# EAGLE schematic AnodV2.1 (EAGLE 5.11)

## Sheet 1 of 2
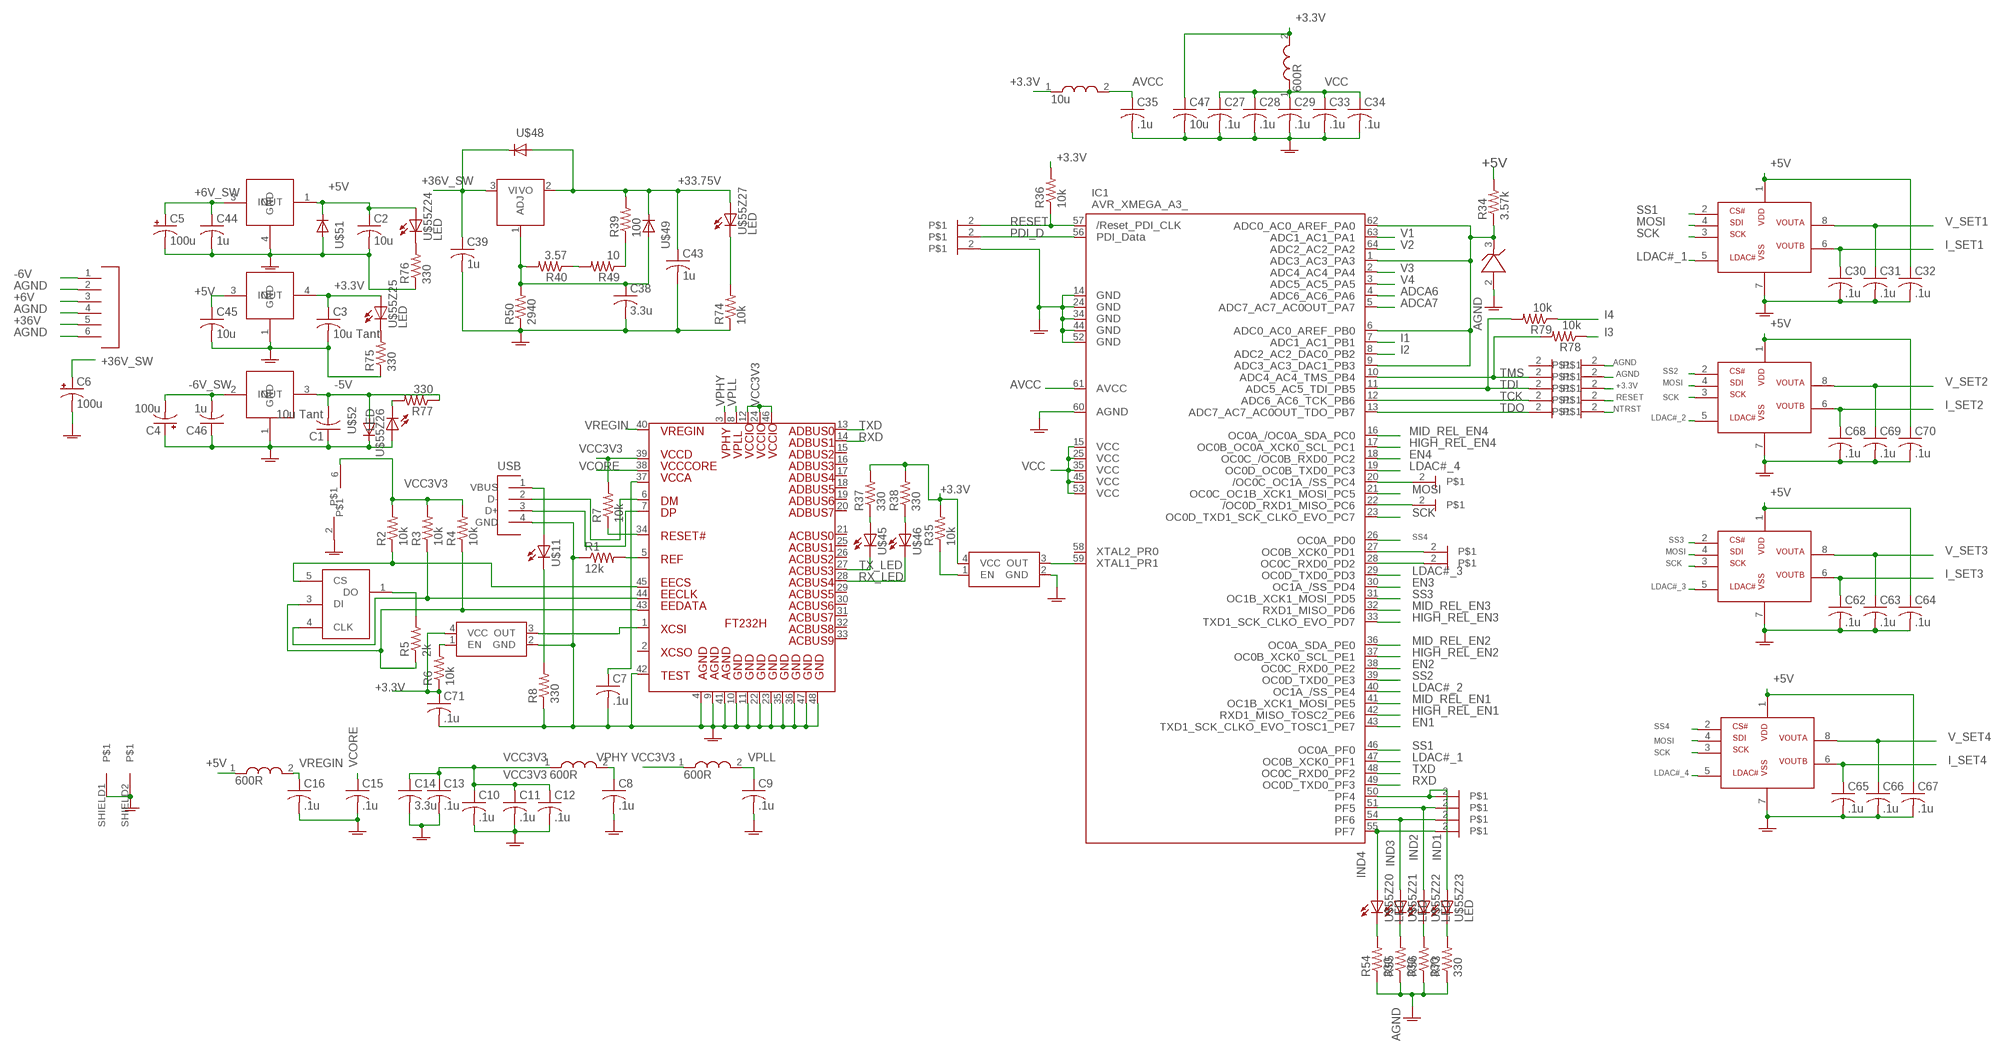
[diagram p0: schematic, sheet 1]

### Parts
C1  10u Tant  C-USC0805  [C0805]
C2  10u  C-USC0805  [C0805]
C3  10u Tant  C-USC0805  [C0805]
C4  100u  CPOL-USE3.5-8  [E3,5-8]
C5  100u  CPOL-USE3.5-8  [E3,5-8]
C6  100u  CPOL-USE3.5-8  [E3,5-8]
C7  .1u  C-USC0603  [C0603]
C8  .1u  C-USC0603  [C0603]
C9  .1u  C-USC0603  [C0603]
C10  .1u  C-USC0603  [C0603]
C11  .1u  C-USC0603  [C0603]
C12  .1u  C-USC0603  [C0603]
C13  .1u  C-USC0603  [C0603]
C14  3.3u  C-USC0603  [C0603]
C15  .1u  C-USC0603  [C0603]
C16  .1u  C-USC0603  [C0603]
C27  .1u  C-USC0603  [C0603]
C28  .1u  C-USC0603  [C0603]
C29  .1u  C-USC0603  [C0603]
C30  .1u  C-USC0603  [C0603]
C31  .1u  C-USC0603  [C0603]
C32  .1u  C-USC0603  [C0603]
C33  .1u  C-USC0603  [C0603]
C34  .1u  C-USC0603  [C0603]
C35  .1u  C-USC0603  [C0603]
C38  3.3u  C-USC0603  [C0603]
C39  1u  C-USC0603  [C0603]
C43  1u  C-USC0603  [C0603]
C44  1u  C-USC0603  [C0603]
C45  10u  C-USC0603  [C0603]
C46  1u  C-USC0603  [C0603]
C47  10u  C-USC0805  [C0805]
C62  .1u  C-USC0603  [C0603]
C63  .1u  C-USC0603  [C0603]
C64  .1u  C-USC0603  [C0603]
C65  .1u  C-USC0603  [C0603]
C66  .1u  C-USC0603  [C0603]
C67  .1u  C-USC0603  [C0603]
C68  .1u  C-USC0603  [C0603]
C69  .1u  C-USC0603  [C0603]
C70  .1u  C-USC0603  [C0603]
C71  .1u  C-USC0603  [C0603]
IC1  AVR_XMEGA_A3_  [TQFP64]
R1  12k  R-US_R0603  [R0603]
R2  10k  R-US_R0603  [R0603]
R3  10k  R-US_R0603  [R0603]
R4  10k  R-US_R0603  [R0603]
R5  2k  R-US_R0603  [R0603]
R6  10k  R-US_R0603  [R0603]
R7  10k  R-US_R0603  [R0603]
R8  330  R-US_R0603  [R0603]
R34  3.57k  R-US_R0603  [R0603]
R35  10k  R-US_R0603  [R0603]
R36  10k  R-US_R0603  [R0603]
R37  330  R-US_R0603  [R0603]
R38  330  R-US_R0603  [R0603]
R39  100  R-US_R0603  [R0603]
R40  3.57  R-US_R0603  [R0603]
R49  10  R-US_R0603  [R0603]
R50  2940  R-US_R0603  [R0603]
R54  330  R-US_R0603  [R0603]
R55  330  R-US_R0603  [R0603]
R56  330  R-US_R0603  [R0603]
R73  330  R-US_R0603  [R0603]
R74  10k  R-US_R0603  [R0603]
R75  330  R-US_R0603  [R0603]
R76  330  R-US_R0603  [R0603]
R77  330  R-US_R0603  [R0603]
R78  10k  R-US_R0603  [R0603]
R79  10k  R-US_R0603  [R0603]
U$1  LM2990  [TO263]
U$2  LP38690TO  [TO252]
U$3  NCP1117_3.3_REG  [TO252]
U$5  FT232H  [LQFP-48]
U$6  OSCILLATOR  [OSC]
U$7  600R  INDUCTOR0603  [0603]
U$8  600R  INDUCTOR0603  [0603]
U$9  EEPROM  [SOT23-6]
U$10  USB_B  [USB_B]
U$11  LED  [CHIPLED_0805]
U$12  600R  INDUCTOR0603  [0603]
U$30  1.22V  ZXRE1004  [SOT23]
U$31  MCP4812_DAC  [MSOP8]
U$32  OSCILLATOR  [OSC]
U$40  10u  INDUCTOR0805  [0805]
U$45  LED  [CHIPLED_0805]
U$46  LED  [CHIPLED_0805]
U$47  LM317  [TO263]
U$48  ES1G-TP_DIODE'  [DO-214AC]
U$49  ES1G-TP_DIODE'  [DO-214AC]
U$50  DIN6_CONNECTOR  [DIN6]
U$51  ES1G-TP_DIODE'  [DO-214AC]
U$52  ES1G-TP_DIODE'  [DO-214AC]
U$53  600R  INDUCTOR0603  [0603]
U$55Z2  HEADER_PIN  [PIN_.100]
U$55Z3  HEADER_PIN  [PIN_.100]
U$55Z4  HEADER_PIN  [PIN_.100]
U$55Z5  HEADER_PIN  [PIN_.100]
U$55Z6  HEADER_PIN  [PIN_.100]
U$55Z7  HEADER_PIN  [PIN_.100]
U$55Z8  HEADER_PIN  [PIN_.100]
U$55Z9  HEADER_PIN  [PIN_.100]
U$55Z10  HEADER_PIN  [PIN_.100]
U$55Z11  HEADER_PIN  [PIN_.100]
U$55Z12  HEADER_PIN  [PIN_.100]
U$55Z13  HEADER_PIN  [PIN_.100]
U$55Z14  HEADER_PIN  [PIN_.100]
U$55Z15  HEADER_PIN  [PIN_.100]
U$55Z16  HEADER_PIN  [PIN_.100]
U$55Z17  HEADER_PIN  [PIN_.100]
U$55Z18  HEADER_PIN  [PIN_.100]
U$55Z19  HEADER_PIN  [PIN_.100]
U$55Z20  LED  [CHIPLED_0805]
U$55Z21  LED  [CHIPLED_0805]
U$55Z22  LED  [CHIPLED_0805]
U$55Z23  LED  [CHIPLED_0805]
U$55Z24  LED  [CHIPLED_0805]
U$55Z25  LED  [CHIPLED_0805]
U$55Z26  LED  [CHIPLED_0805]
U$55Z27  LED  [CHIPLED_0805]
U$55Z28  HEADER_PIN  [PIN_.100]
U$55Z29  HEADER_PIN  [PIN_.100]
U$55Z30  HEADER_PIN  [PIN_.100]
U$56  MCP4812_DAC  [MSOP8]
U$57  MCP4812_DAC  [MSOP8]
U$58  MCP4812_DAC  [MSOP8]

### Nets
+3.3V: C3.1 C47.1 C71.1 R6.1 R35.2 R36.2 R37.2 R38.2 U$3.4(OUT) U$6.4(VCC) U$32.4(VCC) U$40.1 U$53.2 U$55Z9.2 U$55Z25.A
+5V: C2.1 C32.1 C45.1 C64.1 C67.1 C70.1 R34.2 U$2.1(OUT) U$3.3(IN) U$12.1 U$31.1 U$51.C U$55Z24.A U$56.1 U$57.1 U$58.1 ; also sheet 2
+6V: U$50.3
+6V_SW: C5.+ C44.1 U$2.3(IN)
+33.75V: C43.1 R39.2 U$47.2(VO) U$48.A U$49.C U$55Z27.A ; also sheet 2
+36V: U$50.5
+36V_SW: C6.+ C39.1 U$47.3(VI) U$48.C
-5V: C1.2 R77.1 U$1.3(OUT) U$52.A ; also sheet 2
-6V: U$50.1
-6V_SW: C4.- C46.2 U$1.2(IN)
ADCA6: IC1.4(PA6)
ADCA7: IC1.5(PA7)
AGND: C1.1 C2.2 C3.2 C4.+ C5.- C6.- C7.2 C8.2 C9.2 C10.2 C11.2 C12.2 C13.2 C14.2 C15.2 C16.2 C27.2 C28.2 C29.2 C30.2 C31.2 C32.2 C33.2 C34.2 C35.2 C38.2 C39.2 C43.2 C44.2 C45.2 C46.1 C47.2 C62.2 C63.2 C64.2 C65.2 C66.2 C67.2 C68.2 C69.2 C70.2 C71.2 IC1.14(GND1) IC1.24(GND2) IC1.34(GND3) IC1.44(GND4) IC1.52(GND5) IC1.60(AGND) R1.1 R8.1 R50.1 R54.1 R55.1 R56.1 R73.1 R74.1 R75.1 R76.1 U$1.1(GND) U$2.4(GND) U$3.1(GND) U$5.4 U$5.9 U$5.10 U$5.11 U$5.22 U$5.23 U$5.35 U$5.36 U$5.41 U$5.42 U$5.47 U$5.48 U$6.2(GND) U$9.2 U$10.4(GND) U$10.SHIELD1 U$10.SHIELD2 U$30.2(GND) U$31.7 U$32.2(GND) U$50.2 U$50.4 U$50.6 U$51.A U$52.C U$55Z7.2 U$55Z8.2 U$55Z26.A U$55Z30.2 U$56.7 U$57.7 U$58.7 ; also sheet 2
AVCC: C35.1 IC1.61(AVCC) U$40.2
EN1: IC1.43(PE7) ; also sheet 2
EN2: IC1.38(PE2) ; also sheet 2
EN3: IC1.30(PD4) ; also sheet 2
EN4: IC1.18(PC2) ; also sheet 2
HIGH_REL_EN1: IC1.42(PE6) ; also sheet 2
HIGH_REL_EN2: IC1.37(PE1) ; also sheet 2
HIGH_REL_EN3: IC1.33(PD7) ; also sheet 2
HIGH_REL_EN4: IC1.17(PC1) ; also sheet 2
I1: IC1.7(PB1) ; also sheet 2
I2: IC1.8(PB2) ; also sheet 2
I3: R78.1 ; also sheet 2
I4: R79.1 ; also sheet 2
I_SET1: C30.1 U$31.6 ; also sheet 2
I_SET2: C68.1 U$58.6 ; also sheet 2
I_SET3: C62.1 U$56.6 ; also sheet 2
I_SET4: C65.1 U$57.6 ; also sheet 2
IND1: IC1.50(PF4) U$55Z12.2 U$55Z23.A
IND2: IC1.51(PF5) U$55Z13.2 U$55Z22.A
IND3: IC1.54(PF6) U$55Z14.2 U$55Z21.A
IND4: IC1.55(PF7) U$55Z15.2 U$55Z20.A
LDAC#_1: IC1.47(PF1) U$31.5
LDAC#_2: IC1.40(PE4) U$58.5
LDAC#_3: IC1.29(PD3) U$56.5
LDAC#_4: IC1.19(PC3) U$57.5
MID_REL_EN1: IC1.41(PE5) ; also sheet 2
MID_REL_EN2: IC1.36(PE0) ; also sheet 2
MID_REL_EN3: IC1.32(PD6) ; also sheet 2
MID_REL_EN4: IC1.16(PC0) ; also sheet 2
MOSI: IC1.21(PC5) U$31.4 U$56.4 U$57.4 U$58.4
N$2: R1.2 U$5.5
N$3: U$5.1 U$6.3(OUT)
N$5: C7.1 U$5.37
N$6: R2.1 U$5.45 U$9.5(CS)
N$7: R3.1 U$5.44 U$9.4(CLK)
N$8: R4.1 R5.1 U$5.43 U$9.3(DI)
N$9: IC1.22(PC6) U$55Z18.2
N$10: R6.2 U$6.1(EN)
N$11: R5.2 U$9.1(DO)
N$12: R7.1 U$5.34
N$13: U$5.6 U$10.2(D-)
N$14: IC1.28(PD2) U$55Z17.2
N$15: U$5.7 U$10.3(D+)
N$16: U$10.1(VBUS) U$11.A
N$17: R8.2 U$11.C
N$54: IC1.59(PR1) U$32.3(OUT)
N$59: R37.1 U$45.A
N$61: R38.1 U$46.A
N$63: IC1.1(PA3) IC1.6(PB0) IC1.9(PB3) IC1.62(PA0) R34.1 U$30.3(VR)
N$64: C38.1 R40.2 R50.2 U$47.1(ADJ) U$49.A
N$65: R39.1 R49.1
N$66: R35.1 U$32.1(EN)
N$67: R40.1 R49.2
N$68: IC1.20(PC4) U$55Z19.2
N$75: IC1.27(PD1) U$55Z16.2
N$77: R54.2 U$55Z20.C
N$78: R55.2 U$55Z21.C
N$79: R56.2 U$55Z22.C
N$81: R73.2 U$55Z23.C
N$82: R74.2 U$55Z27.C
N$83: R75.2 U$55Z25.C
N$84: R76.2 U$55Z24.C
N$99: R77.2 U$55Z26.C
NTRST: U$55Z11.2
PDI_D: IC1.56(PDI_DATA) U$55Z29.2
RESET: IC1.57(RESET) R36.1 U$55Z10.2 U$55Z28.2
RX_LED: U$5.28 U$46.C
RXD: IC1.49(PF3) U$5.14
SCK: IC1.23(PC7) U$31.3 U$56.3 U$57.3 U$58.3
SS1: IC1.46(PF0) U$31.2
SS2: IC1.39(PE3) U$58.2
SS3: IC1.31(PD5) U$56.2
SS4: IC1.26(PD0) U$57.2
TCK: IC1.12(PB6) U$55Z3.2
TDI: IC1.11(PB5) R79.2 U$55Z4.2
TDO: IC1.13(PB7) U$55Z2.2
TMS: IC1.10(PB4) R78.2 U$55Z5.2
TX_LED: U$5.27 U$45.C
TXD: IC1.48(PF2) U$5.13
V1: IC1.63(PA1) ; also sheet 2
V2: IC1.64(PA2) ; also sheet 2
V3: IC1.2(PA4) ; also sheet 2
V4: IC1.3(PA5) ; also sheet 2
V_SET1: C31.1 U$31.8 ; also sheet 2
V_SET2: C69.1 U$58.8 ; also sheet 2
V_SET3: C63.1 U$56.8 ; also sheet 2
V_SET4: C66.1 U$57.8 ; also sheet 2
VCC: C27.1 C28.1 C29.1 C33.1 C34.1 IC1.15(VCC1) IC1.25(VCC2) IC1.35(VCC3) IC1.45(VCC4) IC1.53(VCC5) U$53.1
VCC3V3: C10.1 C11.1 C12.1 C13.1 C14.1 R2.2 R3.2 R4.2 R7.2 U$5.12 U$5.24 U$5.39 U$5.46 U$7.1 U$8.1 U$9.6
VCORE: C15.1 U$5.38
VPHY: C8.1 U$5.3 U$7.2
VPLL: C9.1 U$5.8 U$8.2
VREGIN: C16.1 U$5.40 U$12.2
Unconnected: IC1.58(PR0) U$5.2 U$5.15 U$5.16 U$5.17 U$5.18 U$5.19 U$5.20 U$5.21 U$5.25 U$5.26 U$5.29 U$5.30 U$5.31 U$5.32 U$5.33 U$55Z6.2

### Notes on the sheet
- USB

## Sheet 2 of 2
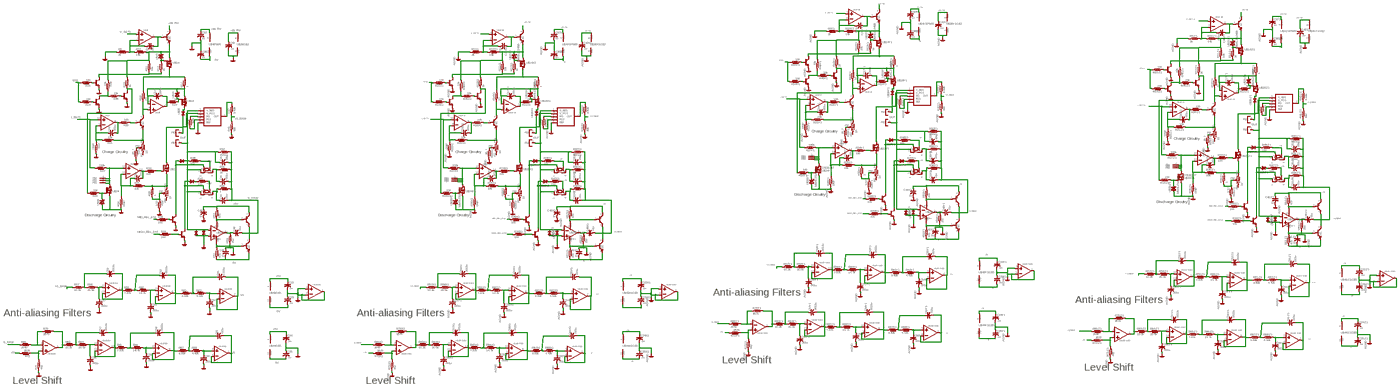
[diagram p1: schematic, sheet 2, overview]
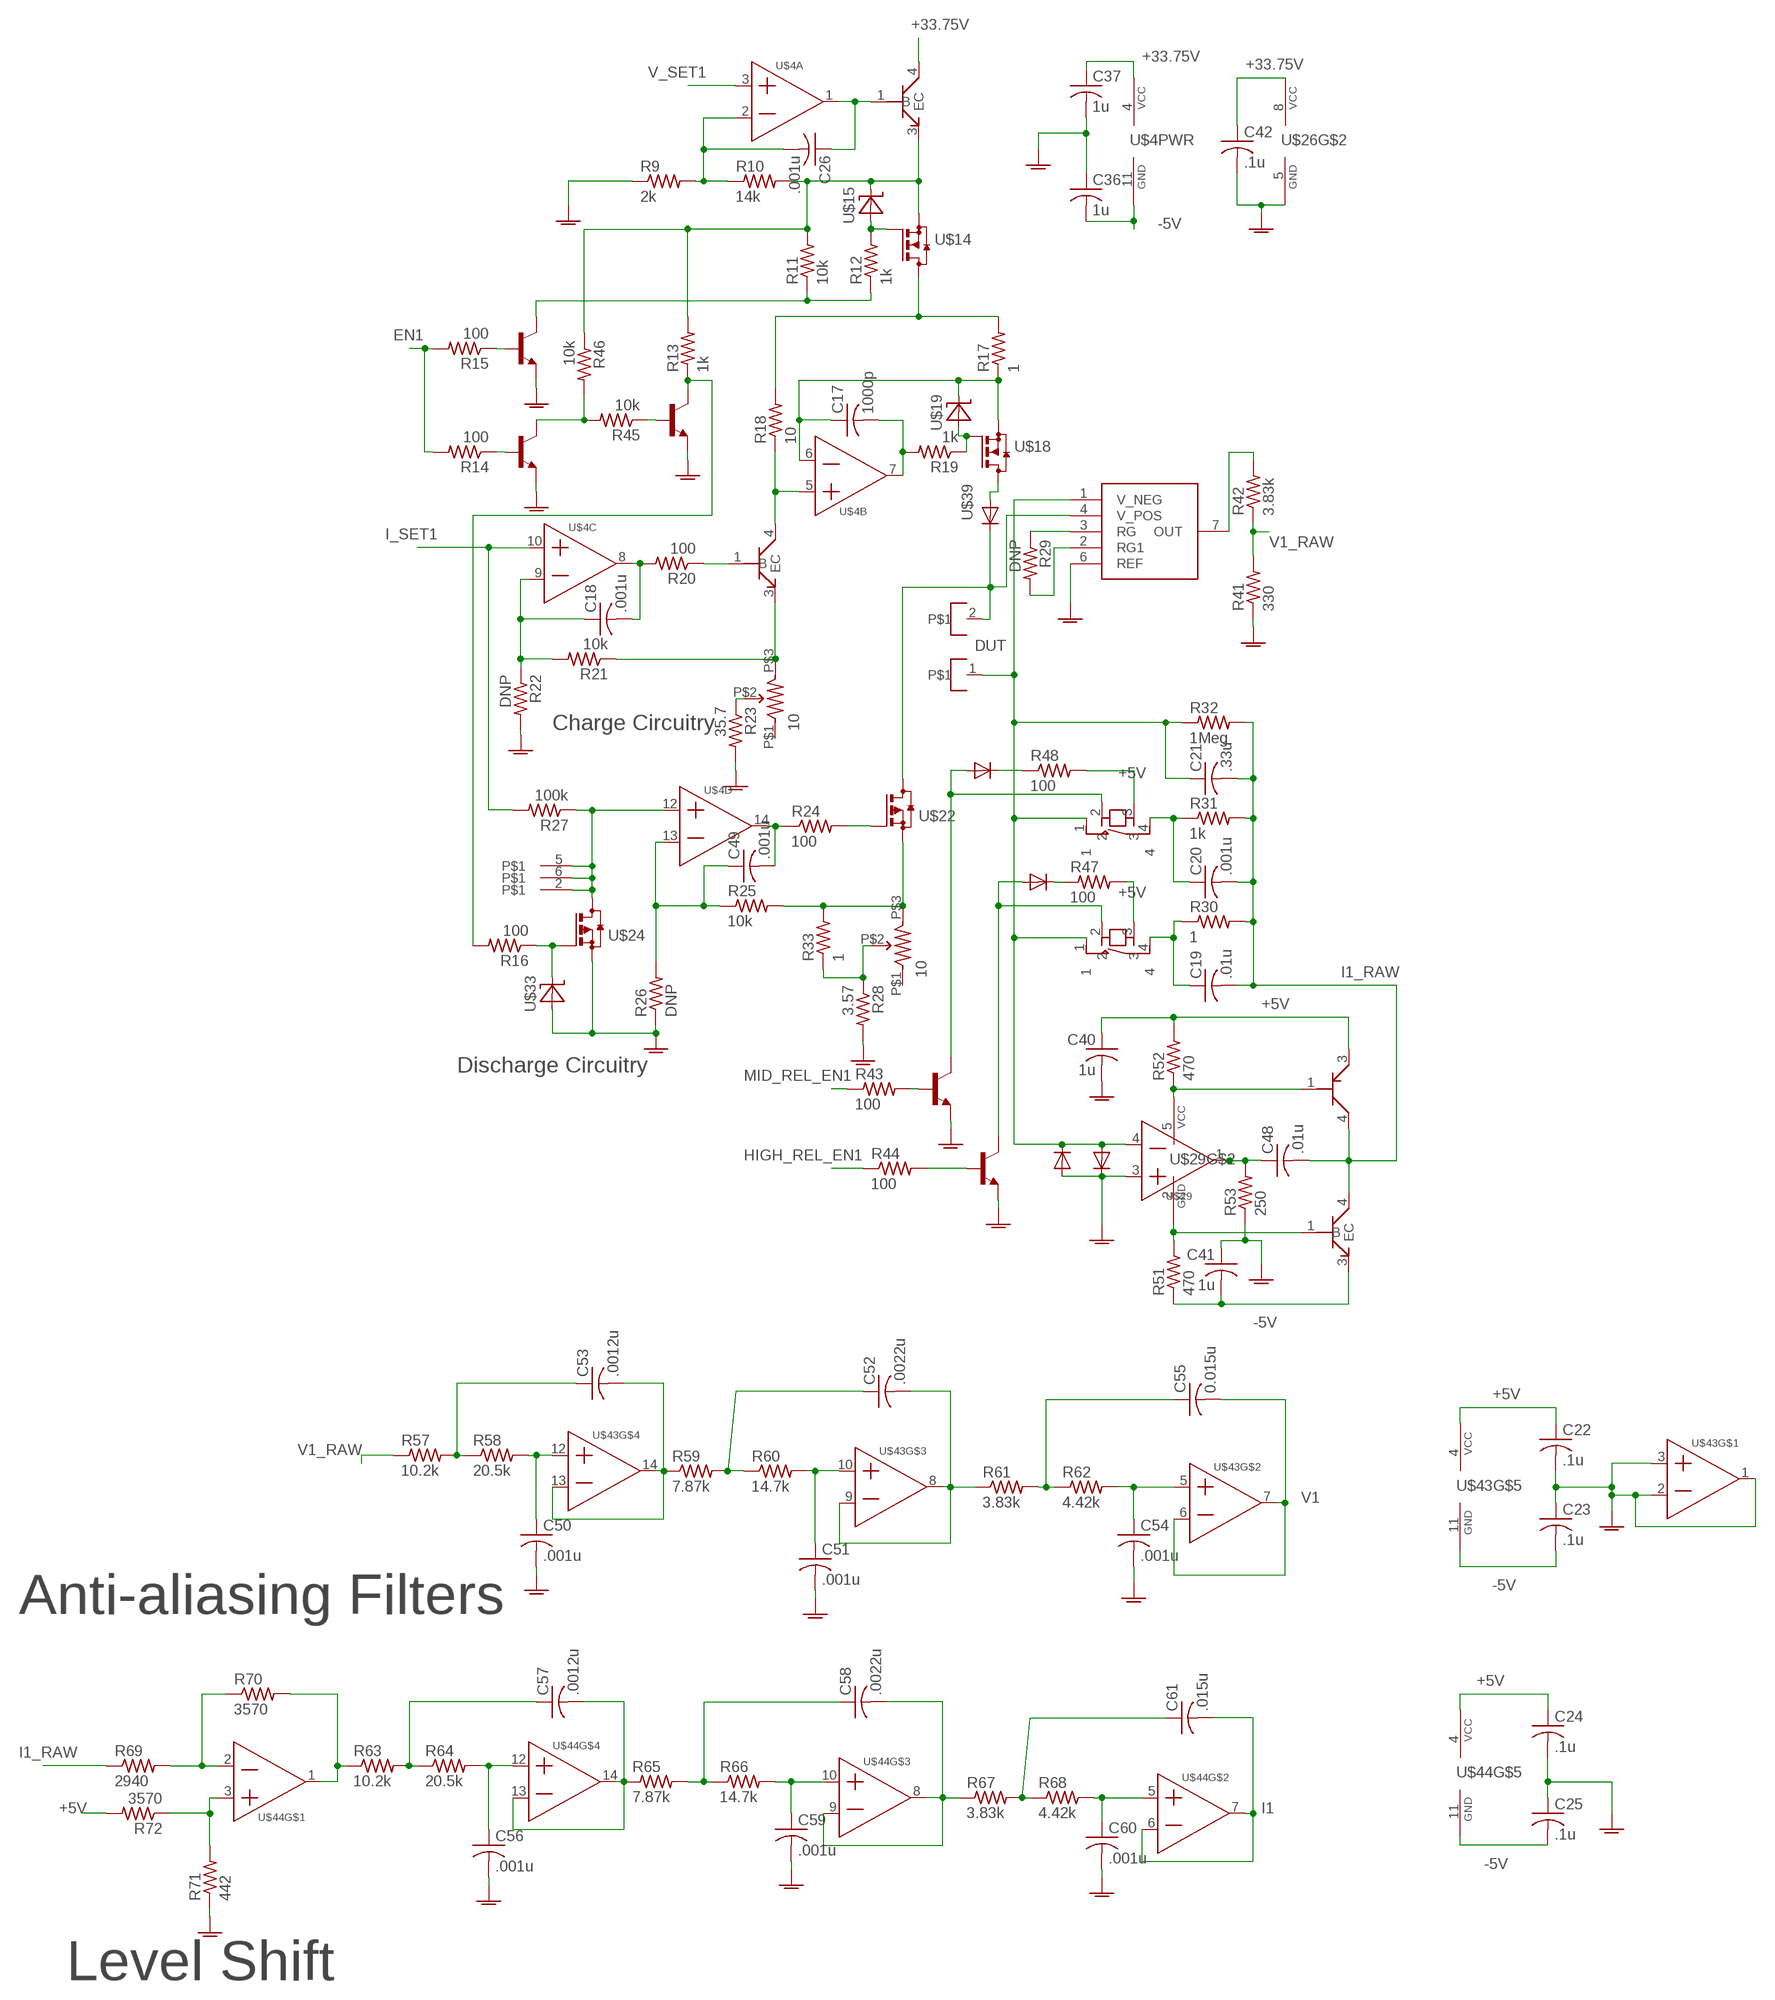
[diagram p2: schematic, sheet 2, part 1 of 4]
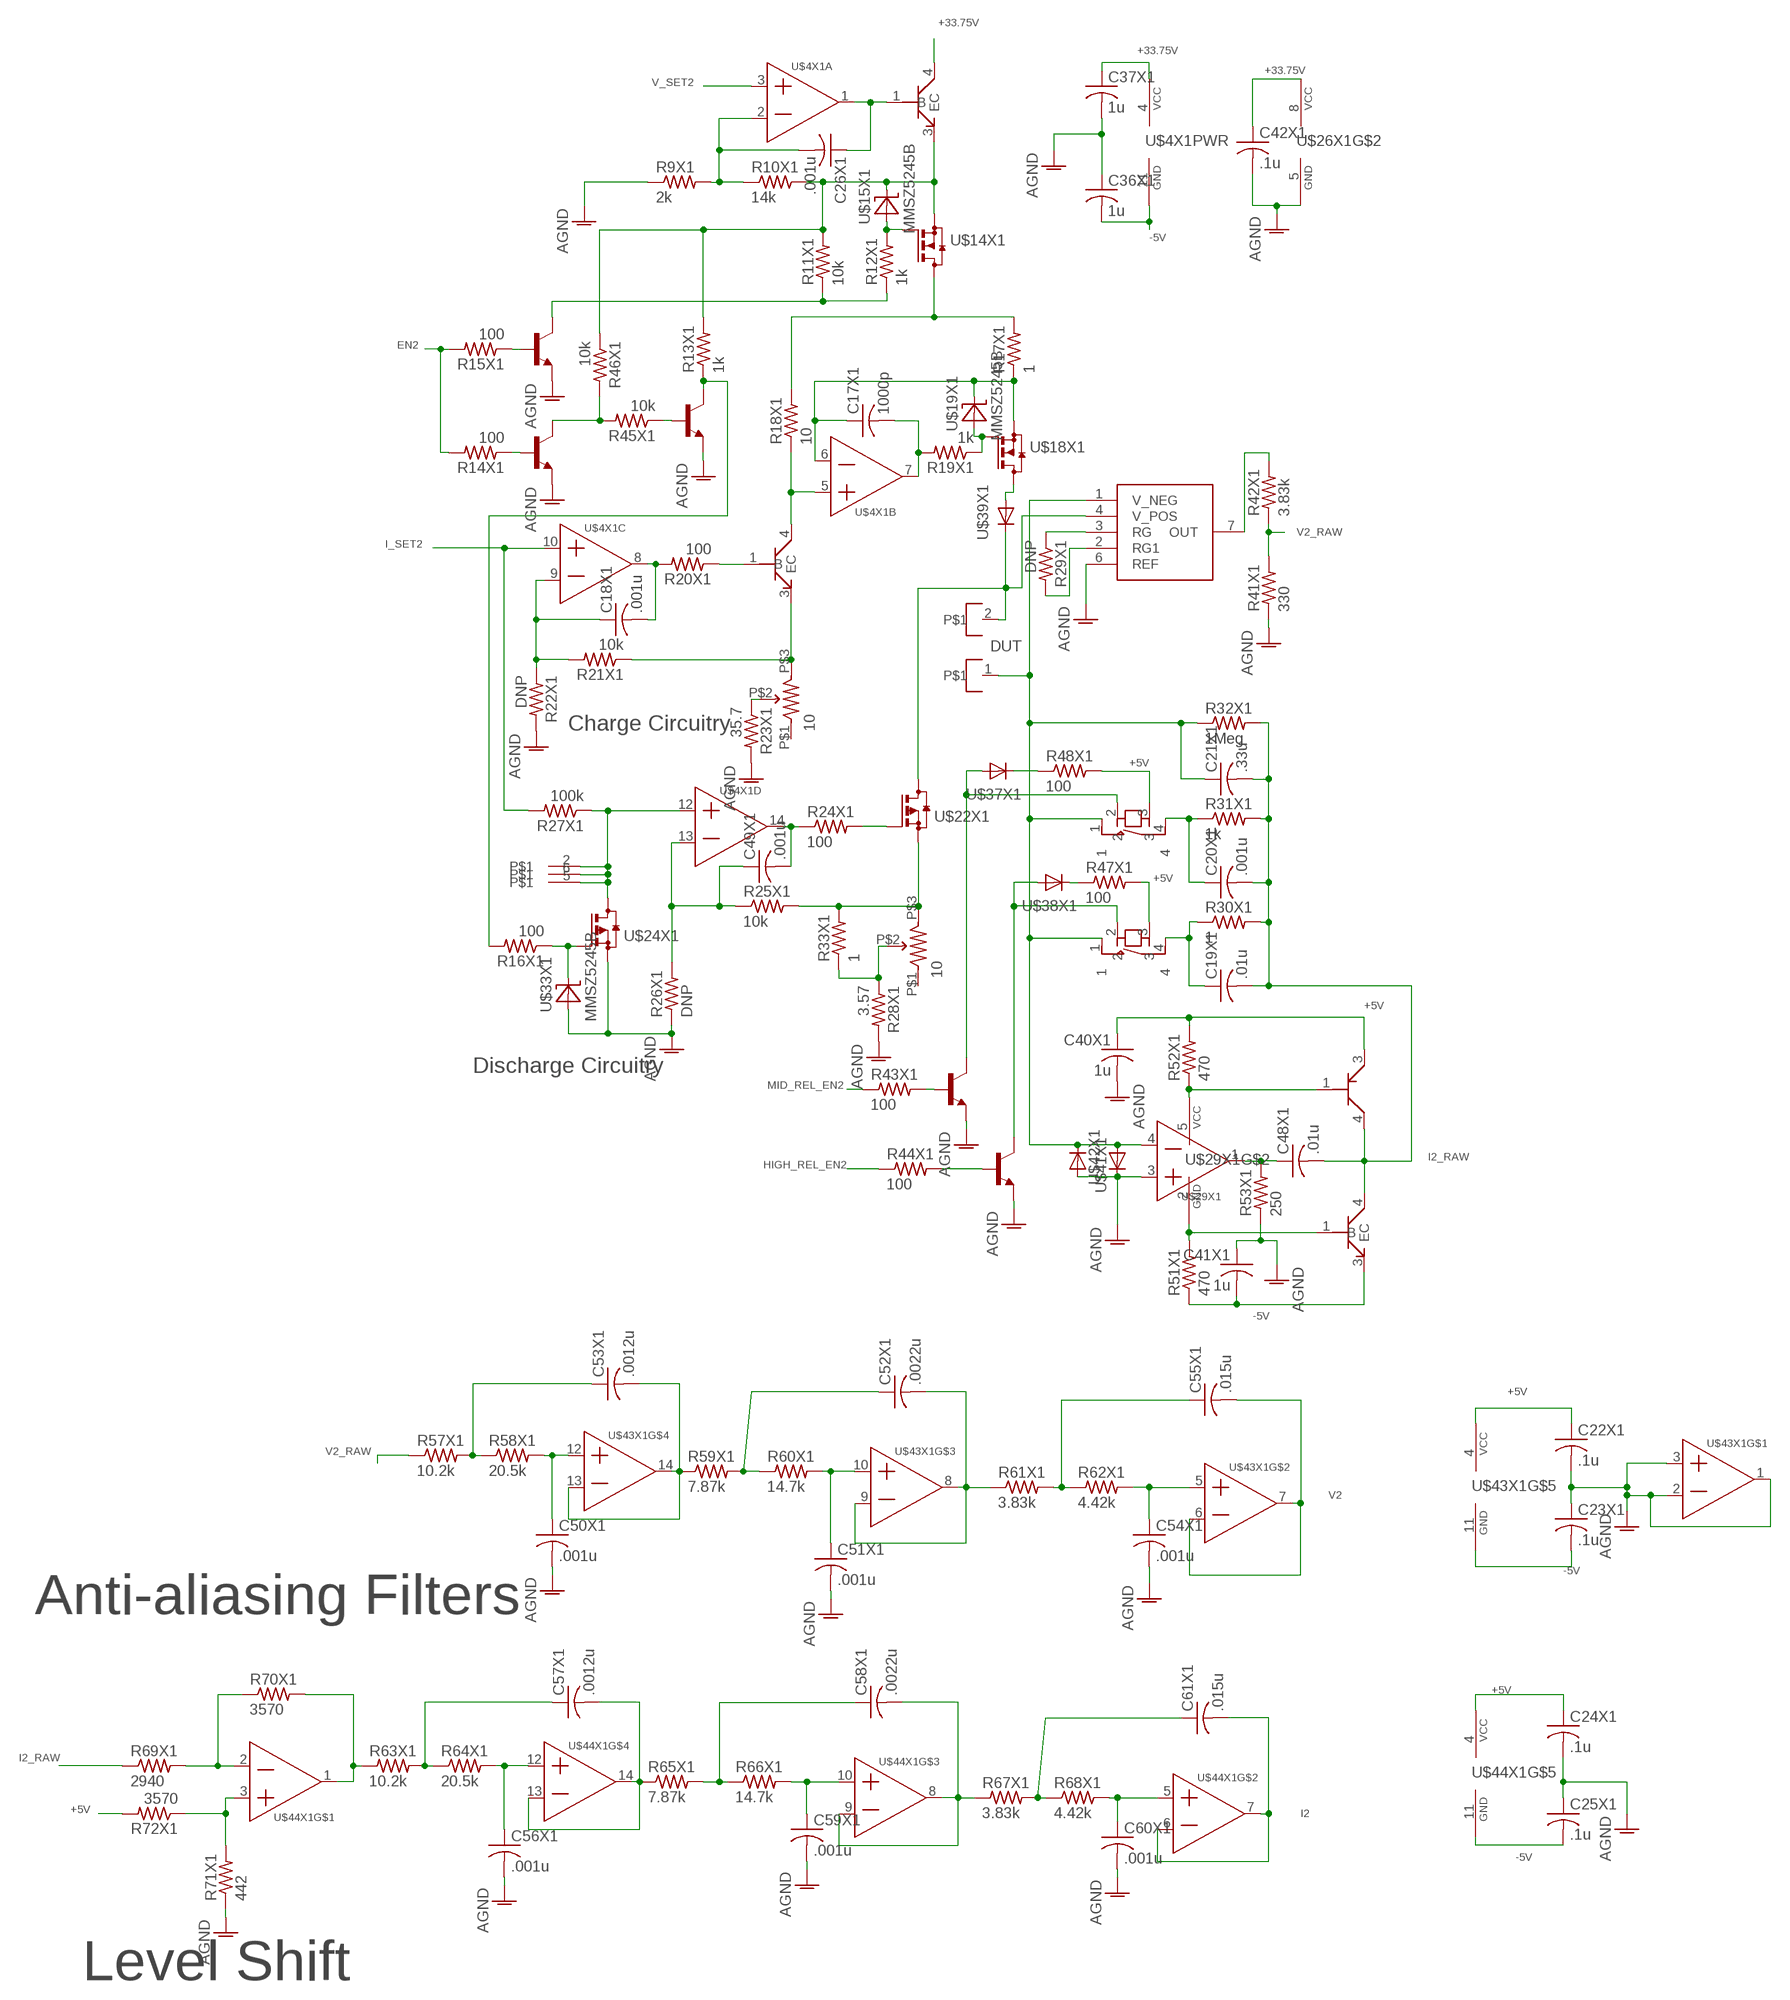
[diagram p3: schematic, sheet 2, part 2 of 4]
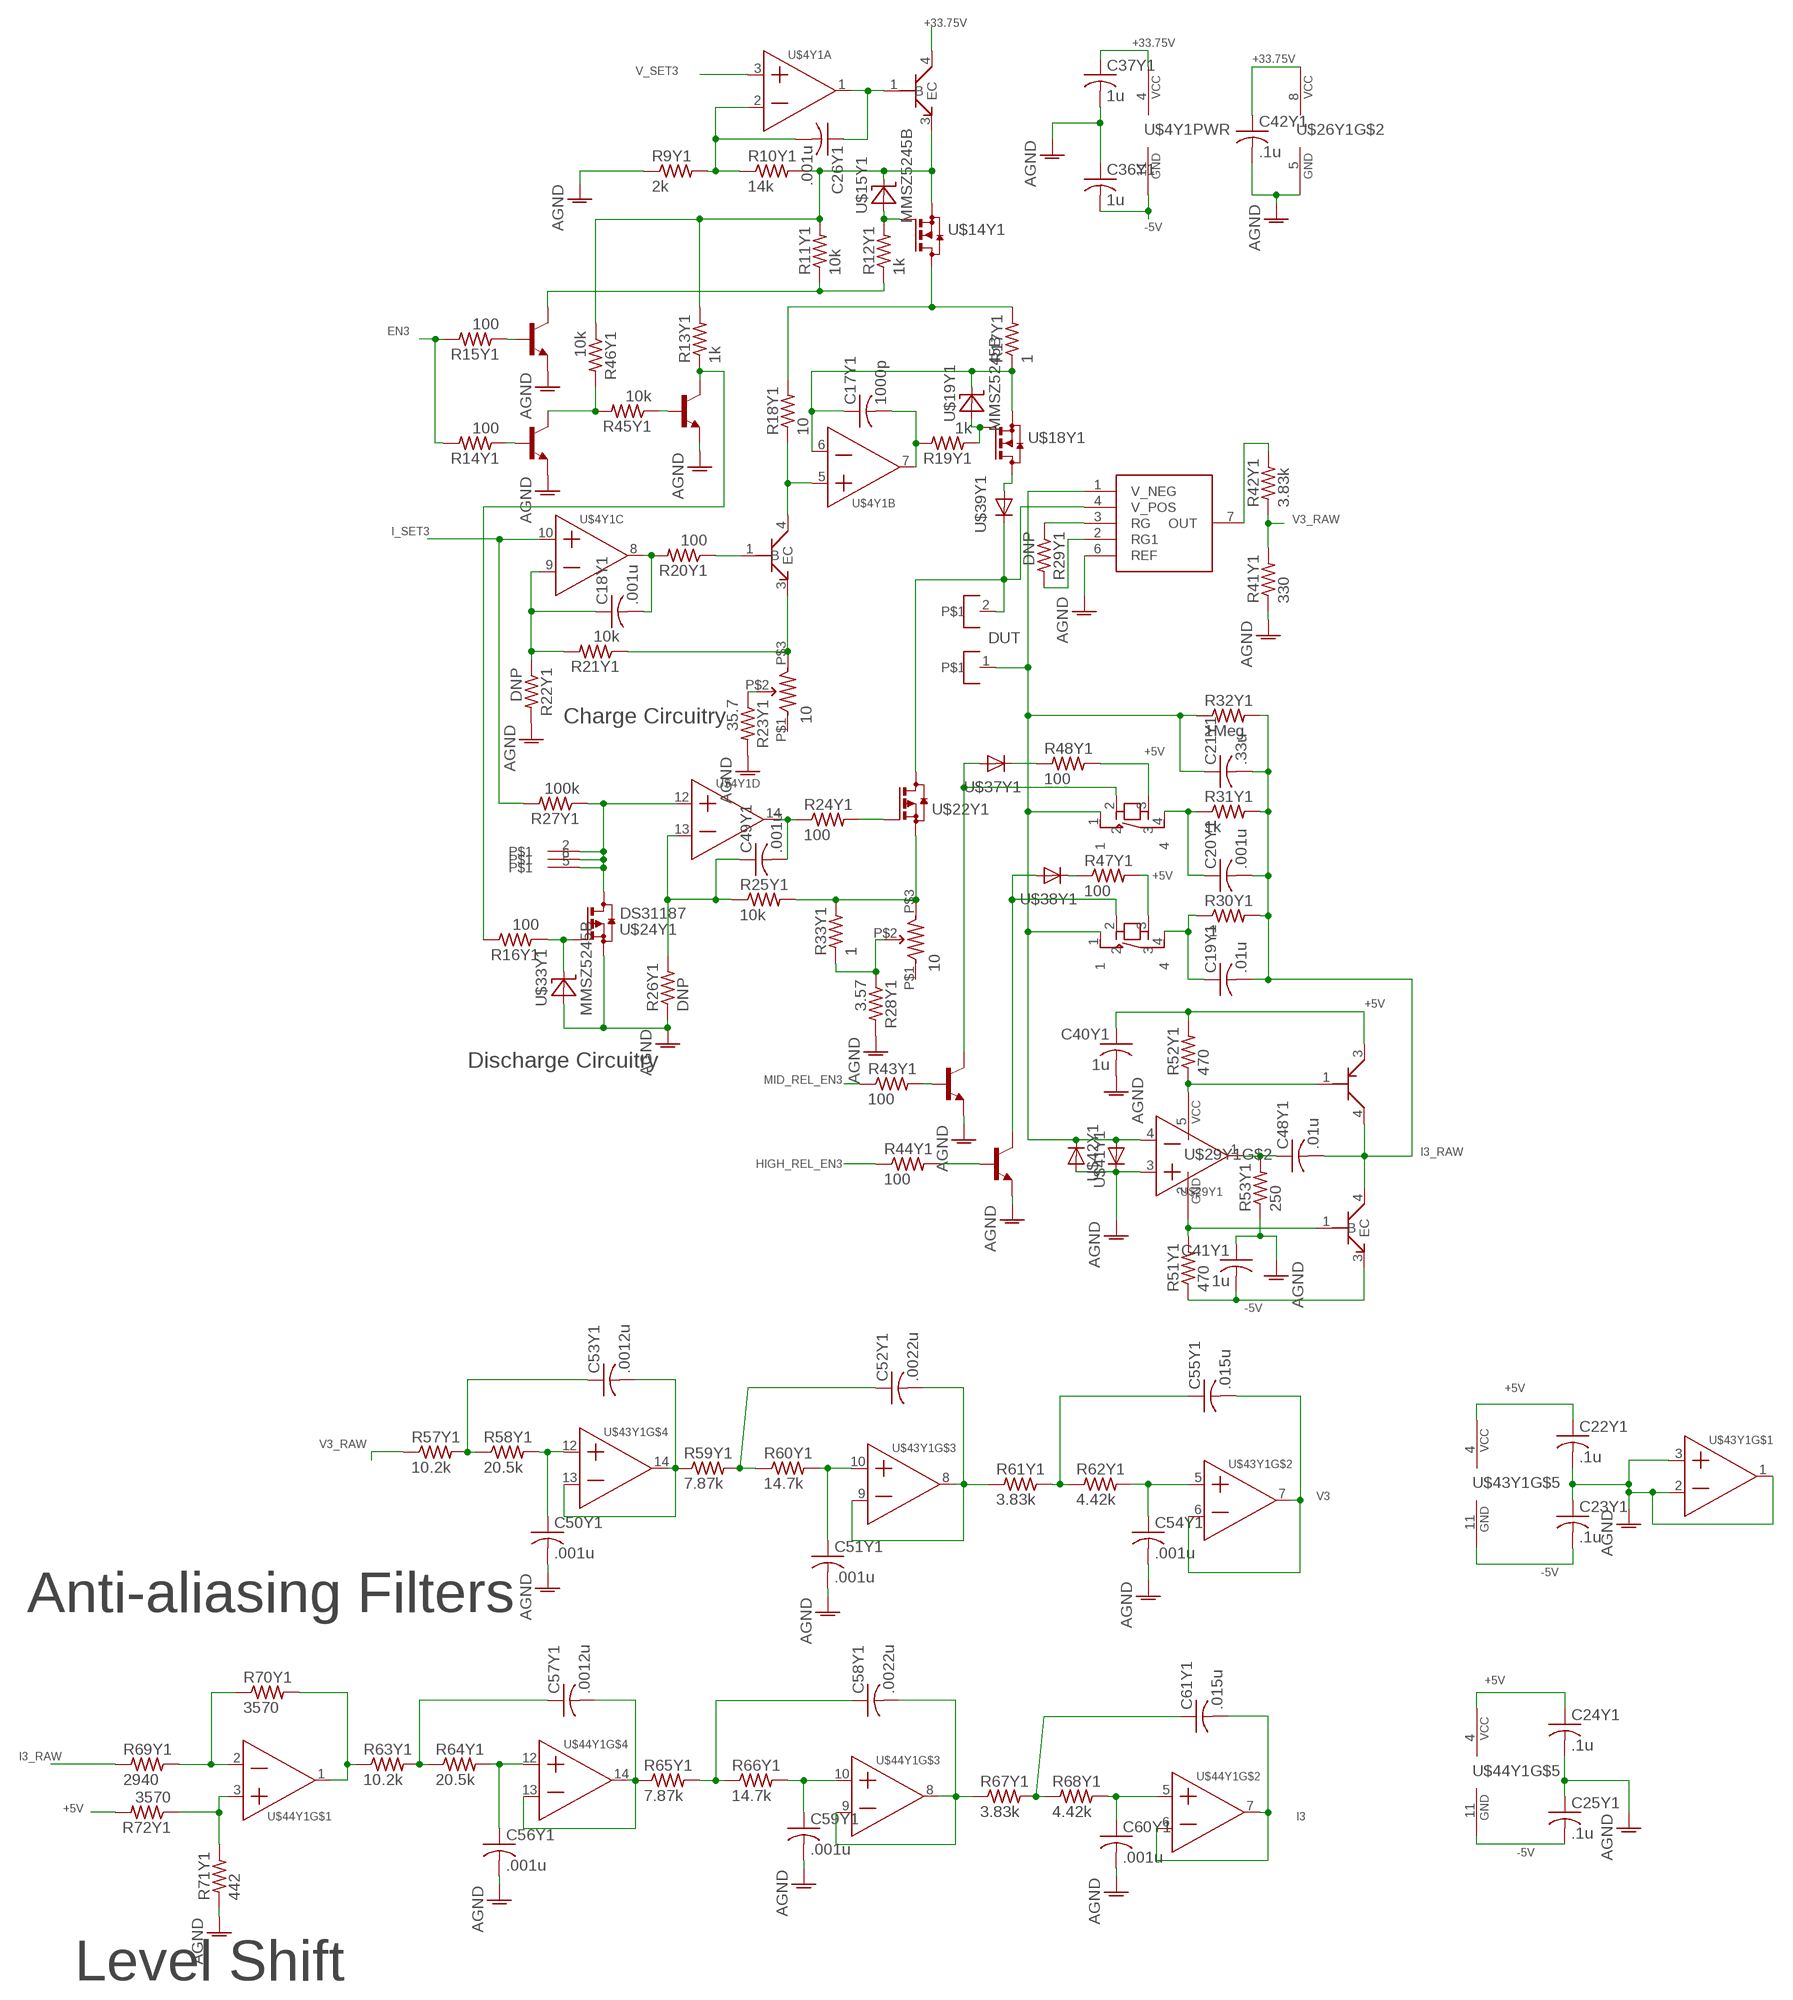
[diagram p4: schematic, sheet 2, part 3 of 4]
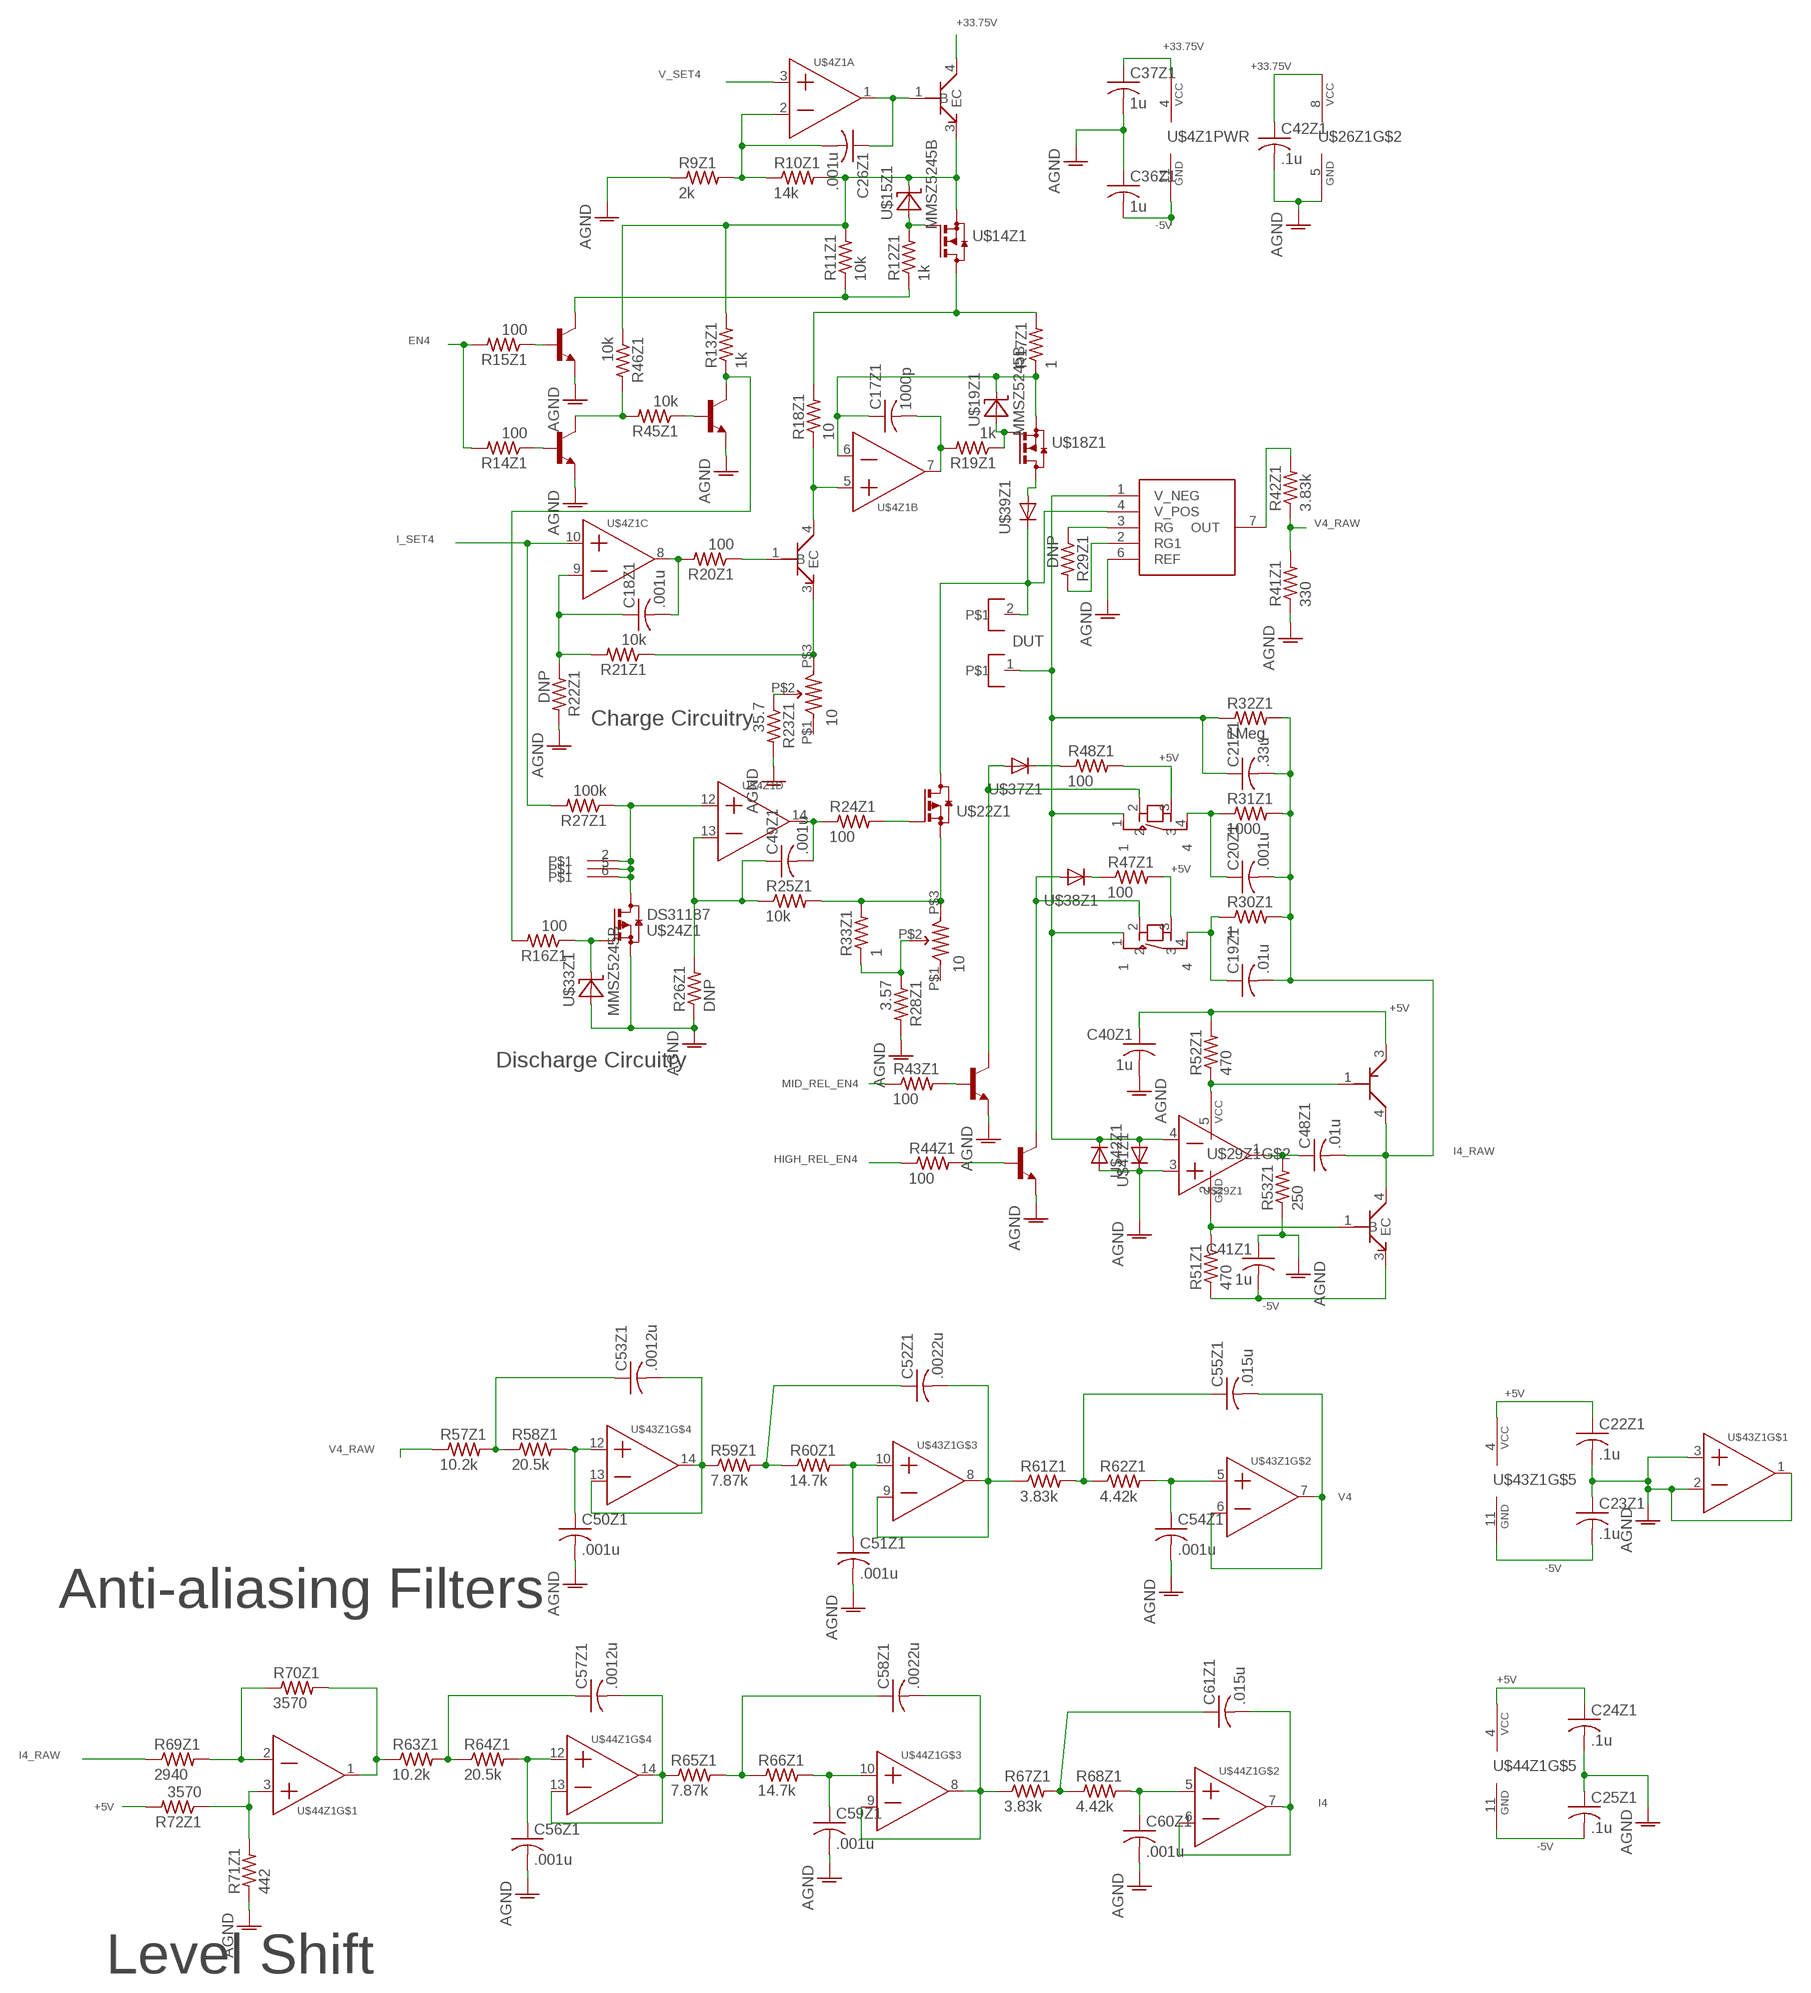
[diagram p5: schematic, sheet 2, part 4 of 4]

### Parts
C17  1000p  C-USC0603  [C0603]
C17X1  1000p  C-USC0603  [C0603]
C17Y1  1000p  C-USC0603  [C0603]
C17Z1  1000p  C-USC0603  [C0603]
C18  .001u  C-USC0603  [C0603]
C18X1  .001u  C-USC0603  [C0603]
C18Y1  .001u  C-USC0603  [C0603]
C18Z1  .001u  C-USC0603  [C0603]
C19  .01u  C-USC0603  [C0603]
C19X1  .01u  C-USC0603  [C0603]
C19Y1  .01u  C-USC0603  [C0603]
C19Z1  .01u  C-USC0603  [C0603]
C20  .001u  C-USC0603  [C0603]
C20X1  .001u  C-USC0603  [C0603]
C20Y1  .001u  C-USC0603  [C0603]
C20Z1  .001u  C-USC0603  [C0603]
C21  .33u  C-USC0603  [C0603]
C21X1  .33u  C-USC0603  [C0603]
C21Y1  .33u  C-USC0603  [C0603]
C21Z1  .33u  C-USC0603  [C0603]
C22  .1u  C-USC0603  [C0603]
C22X1  .1u  C-USC0603  [C0603]
C22Y1  .1u  C-USC0603  [C0603]
C22Z1  .1u  C-USC0603  [C0603]
C23  .1u  C-USC0603  [C0603]
C23X1  .1u  C-USC0603  [C0603]
C23Y1  .1u  C-USC0603  [C0603]
C23Z1  .1u  C-USC0603  [C0603]
C24  .1u  C-USC0603  [C0603]
C24X1  .1u  C-USC0603  [C0603]
C24Y1  .1u  C-USC0603  [C0603]
C24Z1  .1u  C-USC0603  [C0603]
C25  .1u  C-USC0603  [C0603]
C25X1  .1u  C-USC0603  [C0603]
C25Y1  .1u  C-USC0603  [C0603]
C25Z1  .1u  C-USC0603  [C0603]
C26  .001u  C-USC0603  [C0603]
C26X1  .001u  C-USC0603  [C0603]
C26Y1  .001u  C-USC0603  [C0603]
C26Z1  .001u  C-USC0603  [C0603]
C36  1u  C-USC0603  [C0603]
C36X1  1u  C-USC0603  [C0603]
C36Y1  1u  C-USC0603  [C0603]
C36Z1  1u  C-USC0603  [C0603]
C37  1u  C-USC0603  [C0603]
C37X1  1u  C-USC0603  [C0603]
C37Y1  1u  C-USC0603  [C0603]
C37Z1  1u  C-USC0603  [C0603]
C40  1u  C-USC0603  [C0603]
C40X1  1u  C-USC0603  [C0603]
C40Y1  1u  C-USC0603  [C0603]
C40Z1  1u  C-USC0603  [C0603]
C41  1u  C-USC0603  [C0603]
C41X1  1u  C-USC0603  [C0603]
C41Y1  1u  C-USC0603  [C0603]
C41Z1  1u  C-USC0603  [C0603]
C42  .1u  C-USC0603  [C0603]
C42X1  .1u  C-USC0603  [C0603]
C42Y1  .1u  C-USC0603  [C0603]
C42Z1  .1u  C-USC0603  [C0603]
C48  .01u  C-USC0603  [C0603]
C48X1  .01u  C-USC0603  [C0603]
C48Y1  .01u  C-USC0603  [C0603]
C48Z1  .01u  C-USC0603  [C0603]
C49  .001u  C-USC0603  [C0603]
C49X1  .001u  C-USC0603  [C0603]
C49Y1  .001u  C-USC0603  [C0603]
C49Z1  .001u  C-USC0603  [C0603]
C50  .001u  C-USC0603  [C0603]
C50X1  .001u  C-USC0603  [C0603]
C50Y1  .001u  C-USC0603  [C0603]
C50Z1  .001u  C-USC0603  [C0603]
C51  .001u  C-USC0603  [C0603]
C51X1  .001u  C-USC0603  [C0603]
C51Y1  .001u  C-USC0603  [C0603]
C51Z1  .001u  C-USC0603  [C0603]
C52  .0022u  C-USC0603  [C0603]
C52X1  .0022u  C-USC0603  [C0603]
C52Y1  .0022u  C-USC0603  [C0603]
C52Z1  .0022u  C-USC0603  [C0603]
C53  .0012u  C-USC0603  [C0603]
C53X1  .0012u  C-USC0603  [C0603]
C53Y1  .0012u  C-USC0603  [C0603]
C53Z1  .0012u  C-USC0603  [C0603]
C54  .001u  C-USC0603  [C0603]
C54X1  .001u  C-USC0603  [C0603]
C54Y1  .001u  C-USC0603  [C0603]
C54Z1  .001u  C-USC0603  [C0603]
C55  0.015u  C-USC0603  [C0603]
C55X1  .015u  C-USC0603  [C0603]
C55Y1  .015u  C-USC0603  [C0603]
C55Z1  .015u  C-USC0603  [C0603]
C56  .001u  C-USC0603  [C0603]
C56X1  .001u  C-USC0603  [C0603]
C56Y1  .001u  C-USC0603  [C0603]
C56Z1  .001u  C-USC0603  [C0603]
C57  .0012u  C-USC0603  [C0603]
C57X1  .0012u  C-USC0603  [C0603]
C57Y1  .0012u  C-USC0603  [C0603]
C57Z1  .0012u  C-USC0603  [C0603]
C58  .0022u  C-USC0603  [C0603]
C58X1  .0022u  C-USC0603  [C0603]
C58Y1  .0022u  C-USC0603  [C0603]
C58Z1  .0022u  C-USC0603  [C0603]
C59  .001u  C-USC0603  [C0603]
C59X1  .001u  C-USC0603  [C0603]
C59Y1  .001u  C-USC0603  [C0603]
C59Z1  .001u  C-USC0603  [C0603]
C60  .001u  C-USC0603  [C0603]
C60X1  .001u  C-USC0603  [C0603]
C60Y1  .001u  C-USC0603  [C0603]
C60Z1  .001u  C-USC0603  [C0603]
C61  .015u  C-USC0603  [C0603]
C61X1  .015u  C-USC0603  [C0603]
C61Y1  .015u  C-USC0603  [C0603]
C61Z1  .015u  C-USC0603  [C0603]
R9  2k  R-US_R0603  [R0603]
R9X1  2k  R-US_R0603  [R0603]
R9Y1  2k  R-US_R0603  [R0603]
R9Z1  2k  R-US_R0603  [R0603]
R10  14k  R-US_R0603  [R0603]
R10X1  14k  R-US_R0603  [R0603]
R10Y1  14k  R-US_R0603  [R0603]
R10Z1  14k  R-US_R0603  [R0603]
R11  10k  R-US_R0603  [R0603]
R11X1  10k  R-US_R0603  [R0603]
R11Y1  10k  R-US_R0603  [R0603]
R11Z1  10k  R-US_R0603  [R0603]
R12  1k  R-US_R0603  [R0603]
R12X1  1k  R-US_R0603  [R0603]
R12Y1  1k  R-US_R0603  [R0603]
R12Z1  1k  R-US_R0603  [R0603]
R13  1k  R-US_R0603  [R0603]
R13X1  1k  R-US_R0603  [R0603]
R13Y1  1k  R-US_R0603  [R0603]
R13Z1  1k  R-US_R0603  [R0603]
R14  100  R-US_R0603  [R0603]
R14X1  100  R-US_R0603  [R0603]
R14Y1  100  R-US_R0603  [R0603]
R14Z1  100  R-US_R0603  [R0603]
R15  100  R-US_R0603  [R0603]
R15X1  100  R-US_R0603  [R0603]
R15Y1  100  R-US_R0603  [R0603]
R15Z1  100  R-US_R0603  [R0603]
R16  100  R-US_R0603  [R0603]
R16X1  100  R-US_R0603  [R0603]
R16Y1  100  R-US_R0603  [R0603]
R16Z1  100  R-US_R0603  [R0603]
R17  1  R-US_R0603  [R0603]
R17X1  1  R-US_R0603  [R0603]
R17Y1  1  R-US_R0603  [R0603]
R17Z1  1  R-US_R0603  [R0603]
R18  10  R-US_R0603  [R0603]
R18X1  10  R-US_R0603  [R0603]
R18Y1  10  R-US_R0603  [R0603]
R18Z1  10  R-US_R0603  [R0603]
R19  1k  R-US_R0603  [R0603]
R19X1  1k  R-US_R0603  [R0603]
R19Y1  1k  R-US_R0603  [R0603]
R19Z1  1k  R-US_R0603  [R0603]
R20  100  R-US_R0603  [R0603]
R20X1  100  R-US_R0603  [R0603]
R20Y1  100  R-US_R0603  [R0603]
R20Z1  100  R-US_R0603  [R0603]
R21  10k  R-US_R0603  [R0603]
R21X1  10k  R-US_R0603  [R0603]
R21Y1  10k  R-US_R0603  [R0603]
R21Z1  10k  R-US_R0603  [R0603]
R22  DNP  R-US_R0603  [R0603]
R22X1  DNP  R-US_R0603  [R0603]
R22Y1  DNP  R-US_R0603  [R0603]
R22Z1  DNP  R-US_R0603  [R0603]
R23  35.7  R-US_R0603  [R0603]
R23X1  35.7  R-US_R0603  [R0603]
R23Y1  35.7  R-US_R0603  [R0603]
R23Z1  35.7  R-US_R0603  [R0603]
R24  100  R-US_R0603  [R0603]
R24X1  100  R-US_R0603  [R0603]
R24Y1  100  R-US_R0603  [R0603]
R24Z1  100  R-US_R0603  [R0603]
R25  10k  R-US_R0603  [R0603]
R25X1  10k  R-US_R0603  [R0603]
R25Y1  10k  R-US_R0603  [R0603]
R25Z1  10k  R-US_R0603  [R0603]
R26  DNP  R-US_R0603  [R0603]
R26X1  DNP  R-US_R0603  [R0603]
R26Y1  DNP  R-US_R0603  [R0603]
R26Z1  DNP  R-US_R0603  [R0603]
R27  100k  R-US_R0603  [R0603]
R27X1  100k  R-US_R0603  [R0603]
R27Y1  100k  R-US_R0603  [R0603]
R27Z1  100k  R-US_R0603  [R0603]
R28  3.57  R-US_R0603  [R0603]
R28X1  3.57  R-US_R0603  [R0603]
R28Y1  3.57  R-US_R0603  [R0603]
R28Z1  3.57  R-US_R0603  [R0603]
R29  DNP  R-US_R0603  [R0603]
R29X1  DNP  R-US_R0603  [R0603]
R29Y1  DNP  R-US_R0603  [R0603]
R29Z1  DNP  R-US_R0603  [R0603]
R30  1  R-US_R0805  [R0805]
R30X1  1  R-US_R0805  [R0805]
R30Y1  .1  R-US_R0805  [R0805]
R30Z1  1  R-US_R0805  [R0805]
R31  1k  R-US_R0603  [R0603]
R31X1  1k  R-US_R0603  [R0603]
R31Y1  1k  R-US_R0603  [R0603]
R31Z1  1000  R-US_R0603  [R0603]
R32  1Meg  R-US_R0603  [R0603]
R32X1  1Meg  R-US_R0603  [R0603]
R32Y1  1Meg  R-US_R0603  [R0603]
R32Z1  1Meg  R-US_R0603  [R0603]
R33  1  R-US_R0603  [R0603]
R33X1  1  R-US_R0603  [R0603]
R33Y1  1  R-US_R0603  [R0603]
R33Z1  1  R-US_R0603  [R0603]
R41  330  R-US_R0603  [R0603]
R41X1  330  R-US_R0603  [R0603]
R41Y1  330  R-US_R0603  [R0603]
R41Z1  330  R-US_R0603  [R0603]
R42  3.83k  R-US_R0603  [R0603]
R42X1  3.83k  R-US_R0603  [R0603]
R42Y1  3.83k  R-US_R0603  [R0603]
R42Z1  3.83k  R-US_R0603  [R0603]
R43  100  R-US_R0603  [R0603]
R43X1  100  R-US_R0603  [R0603]
R43Y1  100  R-US_R0603  [R0603]
R43Z1  100  R-US_R0603  [R0603]
R44  100  R-US_R0603  [R0603]
R44X1  100  R-US_R0603  [R0603]
R44Y1  100  R-US_R0603  [R0603]
R44Z1  100  R-US_R0603  [R0603]
R45  10k  R-US_R0603  [R0603]
R45X1  10k  R-US_R0603  [R0603]
R45Y1  10k  R-US_R0603  [R0603]
R45Z1  10k  R-US_R0603  [R0603]
R46  10k  R-US_R0603  [R0603]
R46X1  10k  R-US_R0603  [R0603]
R46Y1  10k  R-US_R0603  [R0603]
R46Z1  10k  R-US_R0603  [R0603]
R47  100  R-US_R0603  [R0603]
R47X1  100  R-US_R0603  [R0603]
R47Y1  100  R-US_R0603  [R0603]
R47Z1  100  R-US_R0603  [R0603]
R48  100  R-US_R0603  [R0603]
R48X1  100  R-US_R0603  [R0603]
R48Y1  100  R-US_R0603  [R0603]
R48Z1  100  R-US_R0603  [R0603]
R51  470  R-US_R0603  [R0603]
R51X1  470  R-US_R0603  [R0603]
R51Y1  470  R-US_R0603  [R0603]
R51Z1  470  R-US_R0603  [R0603]
R52  470  R-US_R0603  [R0603]
R52X1  470  R-US_R0603  [R0603]
R52Y1  470  R-US_R0603  [R0603]
R52Z1  470  R-US_R0603  [R0603]
R53  250  R-US_R0603  [R0603]
R53X1  250  R-US_R0603  [R0603]
R53Y1  250  R-US_R0603  [R0603]
R53Z1  250  R-US_R0603  [R0603]
R57  10.2k  R-US_R0603  [R0603]
R57X1  10.2k  R-US_R0603  [R0603]
R57Y1  10.2k  R-US_R0603  [R0603]
R57Z1  10.2k  R-US_R0603  [R0603]
R58  20.5k  R-US_R0603  [R0603]
R58X1  20.5k  R-US_R0603  [R0603]
R58Y1  20.5k  R-US_R0603  [R0603]
R58Z1  20.5k  R-US_R0603  [R0603]
R59  7.87k  R-US_R0603  [R0603]
R59X1  7.87k  R-US_R0603  [R0603]
R59Y1  7.87k  R-US_R0603  [R0603]
R59Z1  7.87k  R-US_R0603  [R0603]
R60  14.7k  R-US_R0603  [R0603]
R60X1  14.7k  R-US_R0603  [R0603]
R60Y1  14.7k  R-US_R0603  [R0603]
R60Z1  14.7k  R-US_R0603  [R0603]
R61  3.83k  R-US_R0603  [R0603]
R61X1  3.83k  R-US_R0603  [R0603]
R61Y1  3.83k  R-US_R0603  [R0603]
R61Z1  3.83k  R-US_R0603  [R0603]
R62  4.42k  R-US_R0603  [R0603]
R62X1  4.42k  R-US_R0603  [R0603]
R62Y1  4.42k  R-US_R0603  [R0603]
R62Z1  4.42k  R-US_R0603  [R0603]
R63  10.2k  R-US_R0603  [R0603]
R63X1  10.2k  R-US_R0603  [R0603]
R63Y1  10.2k  R-US_R0603  [R0603]
R63Z1  10.2k  R-US_R0603  [R0603]
R64  20.5k  R-US_R0603  [R0603]
R64X1  20.5k  R-US_R0603  [R0603]
R64Y1  20.5k  R-US_R0603  [R0603]
R64Z1  20.5k  R-US_R0603  [R0603]
R65  7.87k  R-US_R0603  [R0603]
R65X1  7.87k  R-US_R0603  [R0603]
R65Y1  7.87k  R-US_R0603  [R0603]
R65Z1  7.87k  R-US_R0603  [R0603]
R66  14.7k  R-US_R0603  [R0603]
R66X1  14.7k  R-US_R0603  [R0603]
R66Y1  14.7k  R-US_R0603  [R0603]
R66Z1  14.7k  R-US_R0603  [R0603]
R67  3.83k  R-US_R0603  [R0603]
R67X1  3.83k  R-US_R0603  [R0603]
R67Y1  3.83k  R-US_R0603  [R0603]
R67Z1  3.83k  R-US_R0603  [R0603]
R68  4.42k  R-US_R0603  [R0603]
R68X1  4.42k  R-US_R0603  [R0603]
R68Y1  4.42k  R-US_R0603  [R0603]
R68Z1  4.42k  R-US_R0603  [R0603]
R69  2940  R-US_R0603  [R0603]
R69X1  2940  R-US_R0603  [R0603]
R69Y1  2940  R-US_R0603  [R0603]
R69Z1  2940  R-US_R0603  [R0603]
R70  3570  R-US_R0603  [R0603]
R70X1  3570  R-US_R0603  [R0603]
R70Y1  3570  R-US_R0603  [R0603]
R70Z1  3570  R-US_R0603  [R0603]
R71  442  R-US_R0603  [R0603]
R71X1  442  R-US_R0603  [R0603]
R71Y1  442  R-US_R0603  [R0603]
R71Z1  442  R-US_R0603  [R0603]
R72  3570  R-US_R0603  [R0603]
R72X1  3570  R-US_R0603  [R0603]
R72Y1  3570  R-US_R0603  [R0603]
R72Z1  3570  R-US_R0603  [R0603]
U$4  MC33174DG  [SOIC-14_CUSTOM]
U$4X1  MC33174DG  [SOIC-14_CUSTOM]
U$4Y1  MC33174DG  [SOIC-14_CUSTOM]
U$4Z1  MC33174DG  [SOIC-14_CUSTOM]
U$13  2SD1758  [TO252]
U$13X1  2SD1758  [TO252]
U$13Y1  2SD1758  [TO252]
U$13Z1  2SD1758  [TO252]
U$14  SI2319DS  [SOT23]
U$14X1  SI2319DS  [SOT23]
U$14Y1  SI2319DS  [SOT23]
U$14Z1  SI2319DS  [SOT23]
U$15  MMSZ5245B  [SOD123]
U$15X1  MMSZ5245B  [SOD123]
U$15Y1  MMSZ5245B  [SOD123]
U$15Z1  MMSZ5245B  [SOD123]
U$16  NPN_DSS414  [SOT323-R]
U$16X1  NPN_DSS414  [SOT323-R]
U$16Y1  NPN_DSS414  [SOT323-R]
U$16Z1  NPN_DSS414  [SOT323-R]
U$17  NPN_DSS414  [SOT323-R]
U$17X1  NPN_DSS414  [SOT323-R]
U$17Y1  NPN_DSS414  [SOT323-R]
U$17Z1  NPN_DSS414  [SOT323-R]
U$18  SI2319DS  [SOT23]
U$18X1  SI2319DS  [SOT23]
U$18Y1  SI2319DS  [SOT23]
U$18Z1  SI2319DS  [SOT23]
U$19  MMSZ5245B  [SOD123]
U$19X1  MMSZ5245B  [SOD123]
U$19Y1  MMSZ5245B  [SOD123]
U$19Z1  MMSZ5245B  [SOD123]
U$20  2SD1758  [TO252]
U$20X1  2SD1758  [TO252]
U$20Y1  2SD1758  [TO252]
U$20Z1  2SD1758  [TO252]
U$21  10  POTP  [POT]
U$21X1  10  POTP  [POT]
U$21Y1  10  POTP  [POT]
U$21Z1  10  POTP  [POT]
U$22  RFD3055THROUGH  [TO251AA-V]
U$22X1  RFD3055THROUGH  [TO251AA-V]
U$22Y1  RFD3055THROUGH  [TO251AA-V]
U$22Z1  RFD3055THROUGH  [TO251AA-V]
U$23  10  POTP  [POT]
U$23X1  10  POTP  [POT]
U$23Y1  10  POTP  [POT]
U$23Z1  10  POTP  [POT]
U$24  DS31187  [SOT23-6L]
U$24X1  DS31187  [SOT23-6L]
U$24Y1  DS31187  [SOT23-6L]
U$24Z1  DS31187  [SOT23-6L]
U$25  2TERM  [PLUG_TERM5.08]
U$25X1  2TERM  [PLUG_TERM5.08]
U$25Y1  2TERM  [PLUG_TERM5.08]
U$25Z1  2TERM  [PLUG_TERM5.08]
U$26  AD8220  [MSOP8]
U$26X1  AD8220  [MSOP8]
U$26Y1  AD8220  [MSOP8]
U$26Z1  AD8220  [MSOP8]
U$27  RELAY  [RELAY]
U$27X1  RELAY  [RELAY]
U$27Y1  RELAY  [RELAY]
U$27Z1  RELAY  [RELAY]
U$28  RELAY  [RELAY]
U$28X1  RELAY  [RELAY]
U$28Y1  RELAY  [RELAY]
U$28Z1  RELAY  [RELAY]
U$29  AD8638  [SOT23-5]
U$29X1  AD8638  [SOT23-5]
U$29Y1  AD8638  [SOT23-5]
U$29Z1  AD8638  [SOT23-5]
U$33  MMSZ5245B  [SOD123]
U$33X1  MMSZ5245B  [SOD123]
U$33Y1  MMSZ5245B  [SOD123]
U$33Z1  MMSZ5245B  [SOD123]
U$34  NPN_DSS414  [SOT323-R]
U$34X1  NPN_DSS414  [SOT323-R]
U$34Y1  NPN_DSS414  [SOT323-R]
U$34Z1  NPN_DSS414  [SOT323-R]
U$35  NPN_DSS414  [SOT323-R]
U$35X1  NPN_DSS414  [SOT323-R]
U$35Y1  NPN_DSS414  [SOT323-R]
U$35Z1  NPN_DSS414  [SOT323-R]
U$36  NPN_DSS414  [SOT323-R]
U$36X1  NPN_DSS414  [SOT323-R]
U$36Y1  NPN_DSS414  [SOT323-R]
U$36Z1  NPN_DSS414  [SOT323-R]
U$37  ES1G-TP_DIODE'  [DO-214AC]
U$37X1  ES1G-TP_DIODE'  [DO-214AC]
U$37Y1  ES1G-TP_DIODE'  [DO-214AC]
U$37Z1  ES1G-TP_DIODE'  [DO-214AC]
U$38  ES1G-TP_DIODE'  [DO-214AC]
U$38X1  ES1G-TP_DIODE'  [DO-214AC]
U$38Y1  ES1G-TP_DIODE'  [DO-214AC]
U$38Z1  ES1G-TP_DIODE'  [DO-214AC]
U$39  ES1G-TP_DIODE'  [DO-214AC]
U$39X1  ES1G-TP_DIODE'  [DO-214AC]
U$39Y1  ES1G-TP_DIODE'  [DO-214AC]
U$39Z1  ES1G-TP_DIODE'  [DO-214AC]
U$41  ES1G-TP_DIODE'  [DO-214AC]
U$41X1  ES1G-TP_DIODE'  [DO-214AC]
U$41Y1  ES1G-TP_DIODE'  [DO-214AC]
U$41Z1  ES1G-TP_DIODE'  [DO-214AC]
U$42  ES1G-TP_DIODE'  [DO-214AC]
U$42X1  ES1G-TP_DIODE'  [DO-214AC]
U$42Y1  ES1G-TP_DIODE'  [DO-214AC]
U$42Z1  ES1G-TP_DIODE'  [DO-214AC]
U$43  TLC27M4  [TSSOP14]
U$43X1  TLC27M4  [TSSOP14]
U$43Y1  TLC27M4  [TSSOP14]
U$43Z1  TLC27M4  [TSSOP14]
U$44  TLC27M4  [TSSOP14]
U$44X1  TLC27M4  [TSSOP14]
U$44Y1  TLC27M4  [TSSOP14]
U$44Z1  TLC27M4  [TSSOP14]
U$54  2SD1758  [TO252]
U$54X1  2SD1758  [TO252]
U$54Y1  2SD1758  [TO252]
U$54Z1  2SD1758  [TO252]
U$55  2SB1182  [TO252]
U$55X1  2SB1182  [TO252]
U$55Y1  2SB1182  [TO252]
U$55Z1  2SB1182  [TO252]

### Nets
+5V: C22.1 C22X1.1 C22Y1.1 C22Z1.1 C24.1 C24X1.1 C24Y1.1 C24Z1.1 C40.1 C40X1.1 C40Y1.1 C40Z1.1 R47.2 R47X1.2 R47Y1.2 R47Z1.2 R48.2 R48X1.2 R48Y1.2 R48Z1.2 R52.2 R52X1.2 R52Y1.2 R52Z1.2 R72.2 R72X1.2 R72Y1.2 R72Z1.2 U$27.3 U$27X1.3 U$27Y1.3 U$27Z1.3 U$28.3 U$28X1.3 U$28Y1.3 U$28Z1.3 U$43.4(VCC) U$43X1.4(VCC) U$43Y1.4(VCC) U$43Z1.4(VCC) U$44.4(VCC) U$44X1.4(VCC) U$44Y1.4(VCC) U$44Z1.4(VCC) U$55.3(E) U$55X1.3(E) U$55Y1.3(E) U$55Z1.3(E) ; also sheet 1
+33.75V: C37.1 C37X1.1 C37Y1.1 C37Z1.1 C42.1 C42X1.1 C42Y1.1 C42Z1.1 U$4.4(PWR:VCC) U$4X1.4(PWR:VCC) U$4Y1.4(PWR:VCC) U$4Z1.4(PWR:VCC) U$13.4(C) U$13X1.4(C) U$13Y1.4(C) U$13Z1.4(C) U$26.8(VCC) U$26X1.8(VCC) U$26Y1.8(VCC) U$26Z1.8(VCC) ; also sheet 1
-5V: C23.2 C23X1.2 C23Y1.2 C23Z1.2 C25.2 C25X1.2 C25Y1.2 C25Z1.2 C36.2 C36X1.2 C36Y1.2 C36Z1.2 C41.2 C41X1.2 C41Y1.2 C41Z1.2 R51.1 R51X1.1 R51Y1.1 R51Z1.1 U$4.11(PWR:GND) U$4X1.11(PWR:GND) U$4Y1.11(PWR:GND) U$4Z1.11(PWR:GND) U$43.11(GND) U$43X1.11(GND) U$43Y1.11(GND) U$43Z1.11(GND) U$44.11(GND) U$44X1.11(GND) U$44Y1.11(GND) U$44Z1.11(GND) U$54.3(E) U$54X1.3(E) U$54Y1.3(E) U$54Z1.3(E) ; also sheet 1
AGND: C22.2 C22X1.2 C22Y1.2 C22Z1.2 C23.1 C23X1.1 C23Y1.1 C23Z1.1 C24.2 C24X1.2 C24Y1.2 C24Z1.2 C25.1 C25X1.1 C25Y1.1 C25Z1.1 C36.1 C36X1.1 C36Y1.1 C36Z1.1 C37.2 C37X1.2 C37Y1.2 C37Z1.2 C40.2 C40X1.2 C40Y1.2 C40Z1.2 C41.1 C41X1.1 C41Y1.1 C41Z1.1 C42.2 C42X1.2 C42Y1.2 C42Z1.2 C50.2 C50X1.2 C50Y1.2 C50Z1.2 C51.2 C51X1.2 C51Y1.2 C51Z1.2 C54.2 C54X1.2 C54Y1.2 C54Z1.2 C56.2 C56X1.2 C56Y1.2 C56Z1.2 C59.2 C59X1.2 C59Y1.2 C59Z1.2 C60.2 C60X1.2 C60Y1.2 C60Z1.2 R9.1 R9X1.1 R9Y1.1 R9Z1.1 R22.2 R22X1.2 R22Y1.2 R22Z1.2 R23.2 R23X1.2 R23Y1.2 R23Z1.2 R26.1 R26X1.1 R26Y1.1 R26Z1.1 R28.2 R28X1.2 R28Y1.2 R28Z1.2 R41.1 R41X1.1 R41Y1.1 R41Z1.1 R53.1 R53X1.1 R53Y1.1 R53Z1.1 R71.1 R71X1.1 R71Y1.1 R71Z1.1 U$16.2(E) U$16X1.2(E) U$16Y1.2(E) U$16Z1.2(E) U$17.2(E) U$17X1.2(E) U$17Y1.2(E) U$17Z1.2(E) U$24.4(S) U$24X1.4(S) U$24Y1.4(S) U$24Z1.4(S) U$26.5(GND) U$26.6(REF) U$26X1.5(GND) U$26X1.6(REF) U$26Y1.5(GND) U$26Y1.6(REF) U$26Z1.5(GND) U$26Z1.6(REF) U$29.3(NINV) U$29X1.3(NINV) U$29Y1.3(NINV) U$29Z1.3(NINV) U$33.A U$33X1.A U$33Y1.A U$33Z1.A U$34.2(E) U$34X1.2(E) U$34Y1.2(E) U$34Z1.2(E) U$35.2(E) U$35X1.2(E) U$35Y1.2(E) U$35Z1.2(E) U$36.2(E) U$36X1.2(E) U$36Y1.2(E) U$36Z1.2(E) U$41.A U$41X1.A U$41Y1.A U$41Z1.A U$42.C U$42X1.C U$42Y1.C U$42Z1.C U$43.1(OUT) U$43.2(INV) U$43.3(NINV) U$43X1.1(OUT) U$43X1.2(INV) U$43X1.3(NINV) U$43Y1.1(OUT) U$43Y1.2(INV) U$43Y1.3(NINV) U$43Z1.1(OUT) U$43Z1.2(INV) U$43Z1.3(NINV) ; also sheet 1
EN1: R14.2 R15.2 ; also sheet 1
EN2: R14X1.2 R15X1.2 ; also sheet 1
EN3: R14Y1.2 R15Y1.2 ; also sheet 1
EN4: R14Z1.2 R15Z1.2 ; also sheet 1
HIGH_REL_EN1: R44.1 ; also sheet 1
HIGH_REL_EN2: R44X1.1 ; also sheet 1
HIGH_REL_EN3: R44Y1.1 ; also sheet 1
HIGH_REL_EN4: R44Z1.1 ; also sheet 1
I1: C61.2 U$44.6(INV) U$44.7(OUT) ; also sheet 1
I1_RAW: C19.2 C20.2 C21.2 C48.2 R30.2 R31.2 R32.2 R69.1 U$54.4(C) U$55.4(C)
I2: C61X1.2 U$44X1.6(INV) U$44X1.7(OUT) ; also sheet 1
I2_RAW: C19X1.2 C20X1.2 C21X1.2 C48X1.2 R30X1.2 R31X1.2 R32X1.2 R69X1.1 U$54X1.4(C) U$55X1.4(C)
I3: C61Y1.2 U$44Y1.6(INV) U$44Y1.7(OUT) ; also sheet 1
I3_RAW: C19Y1.2 C20Y1.2 C21Y1.2 C48Y1.2 R30Y1.2 R31Y1.2 R32Y1.2 R69Y1.1 U$54Y1.4(C) U$55Y1.4(C)
I4: C61Z1.2 U$44Z1.6(INV) U$44Z1.7(OUT) ; also sheet 1
I4_RAW: C19Z1.2 C20Z1.2 C21Z1.2 C48Z1.2 R30Z1.2 R31Z1.2 R32Z1.2 R69Z1.1 U$54Z1.4(C) U$55Z1.4(C)
I_SET1: R27.2 U$4.10(C:NINV) ; also sheet 1
I_SET2: R27X1.2 U$4X1.10(C:NINV) ; also sheet 1
I_SET3: R27Y1.2 U$4Y1.10(C:NINV) ; also sheet 1
I_SET4: R27Z1.2 U$4Z1.10(C:NINV) ; also sheet 1
MID_REL_EN1: R43.1 ; also sheet 1
MID_REL_EN2: R43X1.1 ; also sheet 1
MID_REL_EN3: R43Y1.1 ; also sheet 1
MID_REL_EN4: R43Z1.1 ; also sheet 1
N$1: R51.2 U$29.2(GND) U$54.1(B)
N$1X1: R51X1.2 U$29X1.2(GND) U$54X1.1(B)
N$1Y1: R51Y1.2 U$29Y1.2(GND) U$54Y1.1(B)
N$1Z1: R51Z1.2 U$29Z1.2(GND) U$54Z1.1(B)
N$4: R52.1 U$29.5(VCC) U$55.1(B)
N$4X1: R52X1.1 U$29X1.5(VCC) U$55X1.1(B)
N$4Y1: R52Y1.1 U$29Y1.5(VCC) U$55Y1.1(B)
N$4Z1: R52Z1.1 U$29Z1.5(VCC) U$55Z1.1(B)
N$18: C26.2 R9.2 R10.1 U$4.2(A:INV)
N$18X1: C26X1.2 R9X1.2 R10X1.1 U$4X1.2(A:INV)
N$18Y1: C26Y1.2 R9Y1.2 R10Y1.1 U$4Y1.2(A:INV)
N$18Z1: C26Z1.2 R9Z1.2 R10Z1.1 U$4Z1.2(A:INV)
N$19: C53.1 R57.2 R58.1
N$19X1: C53X1.1 R57X1.2 R58X1.1
N$19Y1: C53Y1.1 R57Y1.2 R58Y1.1
N$19Z1: C53Z1.1 R57Z1.2 R58Z1.1
N$20: C26.1 U$4.1(A:OUT) U$13.1(B)
N$20X1: C26X1.1 U$4X1.1(A:OUT) U$13X1.1(B)
N$20Y1: C26Y1.1 U$4Y1.1(A:OUT) U$13Y1.1(B)
N$20Z1: C26Z1.1 U$4Z1.1(A:OUT) U$13Z1.1(B)
N$21: R12.2 U$14.3(G) U$15.A
N$21X1: R12X1.2 U$14X1.3(G) U$15X1.A
N$21Y1: R12Y1.2 U$14Y1.3(G) U$15Y1.A
N$21Z1: R12Z1.2 U$14Z1.3(G) U$15Z1.A
N$22: R13.1 R16.2 U$36.3(C)
N$22X1: R13X1.1 R16X1.2 U$36X1.3(C)
N$22Y1: R13Y1.1 R16Y1.2 U$36Y1.3(C)
N$22Z1: R13Z1.1 R16Z1.2 U$36Z1.3(C)
N$23: R17.2 R18.2 U$14.1(D)
N$23X1: R17X1.2 R18X1.2 U$14X1.1(D)
N$23Y1: R17Y1.2 R18Y1.2 U$14Y1.1(D)
N$23Z1: R17Z1.2 R18Z1.2 U$14Z1.1(D)
N$24: R11.1 R12.1 U$16.3(C)
N$24X1: R11X1.1 R12X1.1 U$16X1.3(C)
N$24Y1: R11Y1.1 R12Y1.1 U$16Y1.3(C)
N$24Z1: R11Z1.1 R12Z1.1 U$16Z1.3(C)
N$25: R15.1 U$16.1(B)
N$25X1: R15X1.1 U$16X1.1(B)
N$25Y1: R15Y1.1 U$16Y1.1(B)
N$25Z1: R15Z1.1 U$16Z1.1(B)
N$26: R47.1 U$38.C
N$26X1: R47X1.1 U$38X1.C
N$26Y1: R47Y1.1 U$38Y1.C
N$26Z1: R47Z1.1 U$38Z1.C
N$27: R42.2 U$26.7(OUT)
N$27X1: R42X1.2 U$26X1.7(OUT)
N$27Y1: R42Y1.2 U$26Y1.7(OUT)
N$27Z1: R42Z1.2 U$26Z1.7(OUT)
N$28: C49.2 R24.1 U$4.14(D:OUT)
N$28X1: C49X1.2 R24X1.1 U$4X1.14(D:OUT)
N$28Y1: C49Y1.2 R24Y1.1 U$4Y1.14(D:OUT)
N$28Z1: C49Z1.2 R24Z1.1 U$4Z1.14(D:OUT)
N$29: C17.2 R19.2 U$4.7(B:OUT)
N$29X1: C17X1.2 R19X1.2 U$4X1.7(B:OUT)
N$29Y1: C17Y1.2 R19Y1.2 U$4Y1.7(B:OUT)
N$29Z1: C17Z1.2 R19Z1.2 U$4Z1.7(B:OUT)
N$30: R19.1 U$18.3(G) U$19.A
N$30X1: R19X1.1 U$18X1.3(G) U$19X1.A
N$30Y1: R19Y1.1 U$18Y1.3(G) U$19Y1.A
N$30Z1: R19Z1.1 U$18Z1.3(G) U$19Z1.A
N$31: C18.2 R20.2 U$4.8(C:OUT)
N$31X1: C18X1.2 R20X1.2 U$4X1.8(C:OUT)
N$31Y1: C18Y1.2 R20Y1.2 U$4Y1.8(C:OUT)
N$31Z1: C18Z1.2 R20Z1.2 U$4Z1.8(C:OUT)
N$32: R18.1 U$4.5(B:NINV) U$20.4(C)
N$32X1: R18X1.1 U$4X1.5(B:NINV) U$20X1.4(C)
N$32Y1: R18Y1.1 U$4Y1.5(B:NINV) U$20Y1.4(C)
N$32Z1: R18Z1.1 U$4Z1.5(B:NINV) U$20Z1.4(C)
N$33: C17.1 R17.1 U$4.6(B:INV) U$18.2(S) U$19.C
N$33X1: C17X1.1 R17X1.1 U$4X1.6(B:INV) U$18X1.2(S) U$19X1.C
N$33Y1: C17Y1.1 R17Y1.1 U$4Y1.6(B:INV) U$18Y1.2(S) U$19Y1.C
N$33Z1: C17Z1.1 R17Z1.1 U$4Z1.6(B:INV) U$18Z1.2(S) U$19Z1.C
N$34: R20.1 U$20.1(B)
N$34X1: R20X1.1 U$20X1.1(B)
N$34Y1: R20Y1.1 U$20Y1.1(B)
N$34Z1: R20Z1.1 U$20Z1.1(B)
N$35: C18.1 R21.2 R22.1 U$4.9(C:INV)
N$35X1: C18X1.1 R21X1.2 R22X1.1 U$4X1.9(C:INV)
N$35Y1: C18Y1.1 R21Y1.2 R22Y1.1 U$4Y1.9(C:INV)
N$35Z1: C18Z1.1 R21Z1.2 R22Z1.1 U$4Z1.9(C:INV)
N$36: R23.1 U$21.P$2
N$36X1: R23X1.1 U$21X1.P$2
N$36Y1: R23Y1.1 U$21Y1.P$2
N$36Z1: R23Z1.1 U$21Z1.P$2
N$37: R21.1 U$20.3(E) U$21.P$3
N$37X1: R21X1.1 U$20X1.3(E) U$21X1.P$3
N$37Y1: R21Y1.1 U$20Y1.3(E) U$21Y1.P$3
N$37Z1: R21Z1.1 U$20Z1.3(E) U$21Z1.P$3
N$38: R24.2 U$22.1(G)
N$38X1: R24X1.2 U$22X1.1(G)
N$38Y1: R24Y1.2 U$22Y1.1(G)
N$38Z1: R24Z1.2 U$22Z1.1(G)
N$39: R25.2 R33.2 U$22.3(S) U$23.P$3
N$39X1: R25X1.2 R33X1.2 U$22X1.3(S) U$23X1.P$3
N$39Y1: R25Y1.2 R33Y1.2 U$22Y1.3(S) U$23Y1.P$3
N$39Z1: R25Z1.2 R33Z1.2 U$22Z1.3(S) U$23Z1.P$3
N$40: C49.1 R25.1 R26.2 U$4.13(D:INV)
N$40X1: C49X1.1 R25X1.1 R26X1.2 U$4X1.13(D:INV)
N$40Y1: C49Y1.1 R25Y1.1 R26Y1.2 U$4Y1.13(D:INV)
N$40Z1: C49Z1.1 R25Z1.1 R26Z1.2 U$4Z1.13(D:INV)
N$41: R28.1 R33.1 U$23.P$2
N$41X1: R28X1.1 R33X1.1 U$23X1.P$2
N$41Y1: R28Y1.1 R33Y1.1 U$23Y1.P$2
N$41Z1: R28Z1.1 R33Z1.1 U$23Z1.P$2
N$42: R27.1 U$4.12(D:NINV) U$24.1(D) U$24.2 U$24.5 U$24.6
N$42X1: R27X1.1 U$4X1.12(D:NINV) U$24X1.1(D) U$24X1.2 U$24X1.5 U$24X1.6
N$42Y1: R27Y1.1 U$4Y1.12(D:NINV) U$24Y1.1(D) U$24Y1.2 U$24Y1.5 U$24Y1.6
N$42Z1: R27Z1.1 U$4Z1.12(D:NINV) U$24Z1.1(D) U$24Z1.2 U$24Z1.5 U$24Z1.6
N$43: C58.2 R67.1 U$44.8(OUT) U$44.9(INV)
N$43X1: C58X1.2 R67X1.1 U$44X1.8(OUT) U$44X1.9(INV)
N$43Y1: C58Y1.2 R67Y1.1 U$44Y1.8(OUT) U$44Y1.9(INV)
N$43Z1: C58Z1.2 R67Z1.1 U$44Z1.8(OUT) U$44Z1.9(INV)
N$44: R16.1 U$24.3(G) U$33.C
N$44X1: R16X1.1 U$24X1.3(G) U$33X1.C
N$44Y1: R16Y1.1 U$24Y1.3(G) U$33Y1.C
N$44Z1: R16Z1.1 U$24Z1.3(G) U$33Z1.C
N$45: U$22.2(D) U$25.2 U$26.4(V_POS) U$39.C
N$45X1: U$22X1.2(D) U$25X1.2 U$26X1.4(V_POS) U$39X1.C
N$45Y1: U$22Y1.2(D) U$25Y1.2 U$26Y1.4(V_POS) U$39Y1.C
N$45Z1: U$22Z1.2(D) U$25Z1.2 U$26Z1.4(V_POS) U$39Z1.C
N$48: R29.1 U$26.3(RG)
N$48X1: R29X1.1 U$26X1.3(RG)
N$48Y1: R29Y1.1 U$26Y1.3(RG)
N$48Z1: R29Z1.1 U$26Z1.3(RG)
N$49: R29.2 U$26.2(RG1)
N$49X1: R29X1.2 U$26X1.2(RG1)
N$49Y1: R29Y1.2 U$26Y1.2(RG1)
N$49Z1: R29Z1.2 U$26Z1.2(RG1)
N$50: C19.1 R30.1 U$27.4
N$50X1: C19X1.1 R30X1.1 U$27X1.4
N$50Y1: C19Y1.1 R30Y1.1 U$27Y1.4
N$50Z1: C19Z1.1 R30Z1.1 U$27Z1.4
N$51: R69.2 R70.1 U$44.2(INV)
N$51X1: R69X1.2 R70X1.1 U$44X1.2(INV)
N$51Y1: R69Y1.2 R70Y1.1 U$44Y1.2(INV)
N$51Z1: R69Z1.2 R70Z1.1 U$44Z1.2(INV)
N$52: C20.1 R31.1 U$28.4
N$52X1: C20X1.1 R31X1.1 U$28X1.4
N$52Y1: C20Y1.1 R31Y1.1 U$28Y1.4
N$52Z1: C20Z1.1 R31Z1.1 U$28Z1.4
N$53: C21.1 R32.1 U$25.1 U$26.1(V_NEG) U$27.1 U$28.1 U$29.4(INV) U$41.C U$42.A
N$53X1: C21X1.1 R32X1.1 U$25X1.1 U$26X1.1(V_NEG) U$27X1.1 U$28X1.1 U$29X1.4(INV) U$41X1.C U$42X1.A
N$53Y1: C21Y1.1 R32Y1.1 U$25Y1.1 U$26Y1.1(V_NEG) U$27Y1.1 U$28Y1.1 U$29Y1.4(INV) U$41Y1.C U$42Y1.A
N$53Z1: C21Z1.1 R32Z1.1 U$25Z1.1 U$26Z1.1(V_NEG) U$27Z1.1 U$28Z1.1 U$29Z1.4(INV) U$41Z1.C U$42Z1.A
N$55: C48.1 R53.2 U$29.1(OUT)
N$55X1: C48X1.1 R53X1.2 U$29X1.1(OUT)
N$55Y1: C48Y1.1 R53Y1.2 U$29Y1.1(OUT)
N$55Z1: C48Z1.1 R53Z1.2 U$29Z1.1(OUT)
N$57: R44.2 U$35.1(B)
N$57X1: R44X1.2 U$35X1.1(B)
N$57Y1: R44Y1.2 U$35Y1.1(B)
N$57Z1: R44Z1.2 U$35Z1.1(B)
N$58: R43.2 U$34.1(B)
N$58X1: R43X1.2 U$34X1.1(B)
N$58Y1: R43Y1.2 U$34Y1.1(B)
N$58Z1: R43Z1.2 U$34Z1.1(B)
N$60: U$28.2 U$34.3(C) U$37.A
N$60X1: U$28X1.2 U$34X1.3(C) U$37X1.A
N$60Y1: U$28Y1.2 U$34Y1.3(C) U$37Y1.A
N$60Z1: U$28Z1.2 U$34Z1.3(C) U$37Z1.A
N$69: U$27.2 U$35.3(C) U$38.A
N$69X1: U$27X1.2 U$35X1.3(C) U$38X1.A
N$69Y1: U$27Y1.2 U$35Y1.3(C) U$38Y1.A
N$69Z1: U$27Z1.2 U$35Z1.3(C) U$38Z1.A
N$70: R14.1 U$17.1(B)
N$70X1: R14X1.1 U$17X1.1(B)
N$70Y1: R14Y1.1 U$17Y1.1(B)
N$70Z1: R14Z1.1 U$17Z1.1(B)
N$71: R45.2 R46.2 U$17.3(C)
N$71X1: R45X1.2 R46X1.2 U$17X1.3(C)
N$71Y1: R45Y1.2 R46Y1.2 U$17Y1.3(C)
N$71Z1: R45Z1.2 R46Z1.2 U$17Z1.3(C)
N$72: R45.1 U$36.1(B)
N$72X1: R45X1.1 U$36X1.1(B)
N$72Y1: R45Y1.1 U$36Y1.1(B)
N$72Z1: R45Z1.1 U$36Z1.1(B)
N$73: R48.1 U$37.C
N$73X1: R48X1.1 U$37X1.C
N$73Y1: R48Y1.1 U$37Y1.C
N$73Z1: R48Z1.1 U$37Z1.C
N$74: U$18.1(D) U$39.A
N$74X1: U$18X1.1(D) U$39X1.A
N$74Y1: U$18Y1.1(D) U$39Y1.A
N$74Z1: U$18Z1.1(D) U$39Z1.A
N$80: R10.2 R11.2 R13.2 R46.1 U$13.3(E) U$14.2(S) U$15.C
N$80X1: R10X1.2 R11X1.2 R13X1.2 R46X1.1 U$13X1.3(E) U$14X1.2(S) U$15X1.C
N$80Y1: R10Y1.2 R11Y1.2 R13Y1.2 R46Y1.1 U$13Y1.3(E) U$14Y1.2(S) U$15Y1.C
N$80Z1: R10Z1.2 R11Z1.2 R13Z1.2 R46Z1.1 U$13Z1.3(E) U$14Z1.2(S) U$15Z1.C
N$85: C50.1 R58.2 U$43.12(NINV)
N$85X1: C50X1.1 R58X1.2 U$43X1.12(NINV)
N$85Y1: C50Y1.1 R58Y1.2 U$43Y1.12(NINV)
N$85Z1: C50Z1.1 R58Z1.2 U$43Z1.12(NINV)
N$86: C53.2 R59.1 U$43.13(INV) U$43.14(OUT)
N$86X1: C53X1.2 R59X1.1 U$43X1.13(INV) U$43X1.14(OUT)
N$86Y1: C53Y1.2 R59Y1.1 U$43Y1.13(INV) U$43Y1.14(OUT)
N$86Z1: C53Z1.2 R59Z1.1 U$43Z1.13(INV) U$43Z1.14(OUT)
N$87: C51.1 R60.2 U$43.10(NINV)
N$87X1: C51X1.1 R60X1.2 U$43X1.10(NINV)
N$87Y1: C51Y1.1 R60Y1.2 U$43Y1.10(NINV)
N$87Z1: C51Z1.1 R60Z1.2 U$43Z1.10(NINV)
N$88: C52.1 R59.2 R60.1
N$88X1: C52X1.1 R59X1.2 R60X1.1
N$88Y1: C52Y1.1 R59Y1.2 R60Y1.1
N$88Z1: C52Z1.1 R59Z1.2 R60Z1.1
N$89: C55.1 R61.2 R62.1
N$89X1: C55X1.1 R61X1.2 R62X1.1
N$89Y1: C55Y1.1 R61Y1.2 R62Y1.1
N$89Z1: C55Z1.1 R61Z1.2 R62Z1.1
N$90: C54.1 R62.2 U$43.5(NINV)
N$90X1: C54X1.1 R62X1.2 U$43X1.5(NINV)
N$90Y1: C54Y1.1 R62Y1.2 U$43Y1.5(NINV)
N$90Z1: C54Z1.1 R62Z1.2 U$43Z1.5(NINV)
N$91: C52.2 R61.1 U$43.8(OUT) U$43.9(INV)
N$91X1: C52X1.2 R61X1.1 U$43X1.8(OUT) U$43X1.9(INV)
N$91Y1: C52Y1.2 R61Y1.1 U$43Y1.8(OUT) U$43Y1.9(INV)
N$91Z1: C52Z1.2 R61Z1.1 U$43Z1.8(OUT) U$43Z1.9(INV)
N$92: C56.1 R64.2 U$44.12(NINV)
N$92X1: C56X1.1 R64X1.2 U$44X1.12(NINV)
N$92Y1: C56Y1.1 R64Y1.2 U$44Y1.12(NINV)
N$92Z1: C56Z1.1 R64Z1.2 U$44Z1.12(NINV)
N$93: C57.1 R63.2 R64.1
N$93X1: C57X1.1 R63X1.2 R64X1.1
N$93Y1: C57Y1.1 R63Y1.2 R64Y1.1
N$93Z1: C57Z1.1 R63Z1.2 R64Z1.1
N$94: C58.1 R65.2 R66.1
N$94X1: C58X1.1 R65X1.2 R66X1.1
N$94Y1: C58Y1.1 R65Y1.2 R66Y1.1
N$94Z1: C58Z1.1 R65Z1.2 R66Z1.1
N$95: C59.1 R66.2 U$44.10(NINV)
N$95X1: C59X1.1 R66X1.2 U$44X1.10(NINV)
N$95Y1: C59Y1.1 R66Y1.2 U$44Y1.10(NINV)
N$95Z1: C59Z1.1 R66Z1.2 U$44Z1.10(NINV)
N$96: C57.2 R65.1 U$44.13(INV) U$44.14(OUT)
N$96X1: C57X1.2 R65X1.1 U$44X1.13(INV) U$44X1.14(OUT)
N$96Y1: C57Y1.2 R65Y1.1 U$44Y1.13(INV) U$44Y1.14(OUT)
N$96Z1: C57Z1.2 R65Z1.1 U$44Z1.13(INV) U$44Z1.14(OUT)
N$97: C61.1 R67.2 R68.1
N$97X1: C61X1.1 R67X1.2 R68X1.1
N$97Y1: C61Y1.1 R67Y1.2 R68Y1.1
N$97Z1: C61Z1.1 R67Z1.2 R68Z1.1
N$98: C60.1 R68.2 U$44.5(NINV)
N$98X1: C60X1.1 R68X1.2 U$44X1.5(NINV)
N$98Y1: C60Y1.1 R68Y1.2 U$44Y1.5(NINV)
N$98Z1: C60Z1.1 R68Z1.2 U$44Z1.5(NINV)
N$100: R71.2 R72.1 U$44.3(NINV)
N$100X1: R71X1.2 R72X1.1 U$44X1.3(NINV)
N$100Y1: R71Y1.2 R72Y1.1 U$44Y1.3(NINV)
N$100Z1: R71Z1.2 R72Z1.1 U$44Z1.3(NINV)
N$102: R63.1 R70.2 U$44.1(OUT)
N$102X1: R63X1.1 R70X1.2 U$44X1.1(OUT)
N$102Y1: R63Y1.1 R70Y1.2 U$44Y1.1(OUT)
N$102Z1: R63Z1.1 R70Z1.2 U$44Z1.1(OUT)
V1: C55.2 U$43.6(INV) U$43.7(OUT) ; also sheet 1
V1_RAW: R41.2 R42.1 R57.1
V2: C55X1.2 U$43X1.6(INV) U$43X1.7(OUT) ; also sheet 1
V2_RAW: R41X1.2 R42X1.1 R57X1.1
V3: C55Y1.2 U$43Y1.6(INV) U$43Y1.7(OUT) ; also sheet 1
V3_RAW: R41Y1.2 R42Y1.1 R57Y1.1
V4: C55Z1.2 U$43Z1.6(INV) U$43Z1.7(OUT) ; also sheet 1
V4_RAW: R41Z1.2 R42Z1.1 R57Z1.1
V_SET1: U$4.3(A:NINV) ; also sheet 1
V_SET2: U$4X1.3(A:NINV) ; also sheet 1
V_SET3: U$4Y1.3(A:NINV) ; also sheet 1
V_SET4: U$4Z1.3(A:NINV) ; also sheet 1
Unconnected: U$21.P$1 U$21X1.P$1 U$21Y1.P$1 U$21Z1.P$1 U$23.P$1 U$23X1.P$1 U$23Y1.P$1 U$23Z1.P$1

### Notes on the sheet
- DUT
- DUT
- Charge Circuitry
- DUT | DUT
- Charge Circuitry
- Charge Circuitry | Charge Circuitry
- Discharge Circuitry
- Discharge Circuitry
- Discharge Circuitry | Discharge Circuitry
- Anti-aliasing Filters
- Anti-aliasing Filters
- Anti-aliasing Filters | Anti-aliasing Filters
- Level Shift
- Level Shift
- Level Shift | Level Shift

## Library data of the parts
C1-C3 C7-C17 C17X1 C17Y1 C17Z1 C18 C18X1 C18Y1 C18Z1 C19 C19X1 C19Y1 C19Z1 C20 C20X1 C20Y1 C20Z1 C21 C21X1 C21Y1 C21Z1 C22 C22X1 C22Y1 C22Z1 C23 C23X1 C23Y1 C23Z1 C24 C24X1 C24Y1 C24Z1 C25 C25X1 C25Y1 C25Z1 C26 C26X1 C26Y1 C26Z1 C27-C36 C36X1 C36Y1 C36Z1 C37 C37X1 C37Y1 C37Z1 C38-C40 C40X1 C40Y1 C40Z1 C41 C41X1 C41Y1 C41Z1 C42 C42X1 C42Y1 C42Z1 C43-C48 C48X1 C48Y1 C48Z1 C49 C49X1 C49Y1 C49Z1 C50 C50X1 C50Y1 C50Z1 C51 C51X1 C51Y1 C51Z1 C52 C52X1 C52Y1 C52Z1 C53 C53X1 C53Y1 C53Z1 C54 C54X1 C54Y1 C54Z1 C55 C55X1 C55Y1 C55Z1 C56 C56X1 C56Y1 C56Z1 C57 C57X1 C57Y1 C57Z1 C58 C58X1 C58Y1 C58Z1 C59 C59X1 C59Y1 C59Z1 C60 C60X1 C60Y1 C60Z1 C61 C61X1 C61Y1 C61Z1 C62-C71 = AnodV2.0_lib:C-US: CAPACITOR, American symbol
C4-C6 = AnodV2.0_lib:CPOL-US: POLARIZED CAPACITOR, American symbol
IC1 = AnodV2.0_lib:AVR_XMEGA_A3_: Device for Atmel AVR XMEGA A3 Series
R1-R9 R9X1 R9Y1 R9Z1 R10 R10X1 R10Y1 R10Z1 R11 R11X1 R11Y1 R11Z1 R12 R12X1 R12Y1 R12Z1 R13 R13X1 R13Y1 R13Z1 R14 R14X1 R14Y1 R14Z1 R15 R15X1 R15Y1 R15Z1 R16 R16X1 R16Y1 R16Z1 R17 R17X1 R17Y1 R17Z1 R18 R18X1 R18Y1 R18Z1 R19 R19X1 R19Y1 R19Z1 R20 R20X1 R20Y1 R20Z1 R21 R21X1 R21Y1 R21Z1 R22 R22X1 R22Y1 R22Z1 R23 R23X1 R23Y1 R23Z1 R24 R24X1 R24Y1 R24Z1 R25 R25X1 R25Y1 R25Z1 R26 R26X1 R26Y1 R26Z1 R27 R27X1 R27Y1 R27Z1 R28 R28X1 R28Y1 R28Z1 R29 R29X1 R29Y1 R29Z1 R30 R30X1 R30Y1 R30Z1 R31 R31X1 R31Y1 R31Z1 R32 R32X1 R32Y1 R32Z1 R33 R33X1 R33Y1 R33Z1 R34-R41 R41X1 R41Y1 R41Z1 R42 R42X1 R42Y1 R42Z1 R43 R43X1 R43Y1 R43Z1 R44 R44X1 R44Y1 R44Z1 R45 R45X1 R45Y1 R45Z1 R46 R46X1 R46Y1 R46Z1 R47 R47X1 R47Y1 R47Z1 R48 R48X1 R48Y1 R48Z1 R49-R51 R51X1 R51Y1 R51Z1 R52 R52X1 R52Y1 R52Z1 R53 R53X1 R53Y1 R53Z1 R54-R57 R57X1 R57Y1 R57Z1 R58 R58X1 R58Y1 R58Z1 R59 R59X1 R59Y1 R59Z1 R60 R60X1 R60Y1 R60Z1 R61 R61X1 R61Y1 R61Z1 R62 R62X1 R62Y1 R62Z1 R63 R63X1 R63Y1 R63Z1 R64 R64X1 R64Y1 R64Z1 R65 R65X1 R65Y1 R65Z1 R66 R66X1 R66Y1 R66Z1 R67 R67X1 R67Y1 R67Z1 R68 R68X1 R68Y1 R68Z1 R69 R69X1 R69Y1 R69Z1 R70 R70X1 R70Y1 R70Z1 R71 R71X1 R71Y1 R71Z1 R72 R72X1 R72Y1 R72Z1 R73-R79 = AnodV2.0_lib:R-US_: RESISTOR, American symbol
U$1 = AnodV2.0_lib:LM2990
U$2 = AnodV2.0_lib:LP38690
U$3 = AnodV2.0_lib:NCP1117_3.3_REG
U$4 U$4X1 U$4Y1 U$4Z1 = AnodV2.0_lib:MC33174DG
U$5 = AnodV2.0_lib:FT232H
U$6 U$32 = AnodV2.0_lib:OSCILLATOR
U$7 U$8 U$12 U$40 U$53 = AnodV2.0_lib:INDUCTOR
U$9 = AnodV2.0_lib:EEPROM
U$10 = AnodV2.0_lib:USB_B
U$11 U$45 U$46 U$55Z20-U$55Z27 = AnodV2.0_lib:LED
U$13 U$13X1 U$13Y1 U$13Z1 U$20 U$20X1 U$20Y1 U$20Z1 U$54 U$54X1 U$54Y1 U$54Z1 = AnodV2.0_lib:2SD1758
U$14 U$14X1 U$14Y1 U$14Z1 U$18 U$18X1 U$18Y1 U$18Z1 = AnodV2.0_lib:SI2319DS
U$15 U$15X1 U$15Y1 U$15Z1 U$19 U$19X1 U$19Y1 U$19Z1 U$33 U$33X1 U$33Y1 U$33Z1 = AnodV2.0_lib:MMSZ5245B
U$16 U$16X1 U$16Y1 U$16Z1 U$17 U$17X1 U$17Y1 U$17Z1 U$34 U$34X1 U$34Y1 U$34Z1 U$35 U$35X1 U$35Y1 U$35Z1 U$36 U$36X1 U$36Y1 U$36Z1 = AnodV2.0_lib:NPN_DSS414
U$21 U$21X1 U$21Y1 U$21Z1 U$23 U$23X1 U$23Y1 U$23Z1 = AnodV2.0_lib:POT
U$22 U$22X1 U$22Y1 U$22Z1 = AnodV2.0_lib:RFD3055
U$24 U$24X1 U$24Y1 U$24Z1 = AnodV2.0_lib:DS31187
U$25 U$25X1 U$25Y1 U$25Z1 = AnodV2.0_lib:2TERM
U$26 U$26X1 U$26Y1 U$26Z1 = AnodV2.0_lib:AD8220
U$27 U$27X1 U$27Y1 U$27Z1 U$28 U$28X1 U$28Y1 U$28Z1 = AnodV2.0_lib:RELAY
U$29 U$29X1 U$29Y1 U$29Z1 = AnodV2.0_lib:AD8638
U$30 = AnodV2.0_lib:ZXRE1004
U$31 U$56-U$58 = AnodV2.0_lib:MCP4812_DAC
U$37 U$37X1 U$37Y1 U$37Z1 U$38 U$38X1 U$38Y1 U$38Z1 U$39 U$39X1 U$39Y1 U$39Z1 U$41 U$41X1 U$41Y1 U$41Z1 U$42 U$42X1 U$42Y1 U$42Z1 U$48 U$49 U$51 U$52 = AnodV2.0_lib:ES1G-TP_DIODE'
U$43 U$43X1 U$43Y1 U$43Z1 U$44 U$44X1 U$44Y1 U$44Z1 = AnodV2.0_lib:TLC27M4
U$47 = AnodV2.0_lib:LM317
U$50 = AnodV2.0_lib:DIN6_CONNECTOR
U$55 U$55X1 U$55Y1 U$55Z1 = AnodV2.0_lib:2SB1182
U$55Z2-U$55Z19 U$55Z28-U$55Z30 = AnodV2.0_lib:HEADER_PIN